# Altium project FMC_130MSPS.PrjPCB (part 1 of 3)
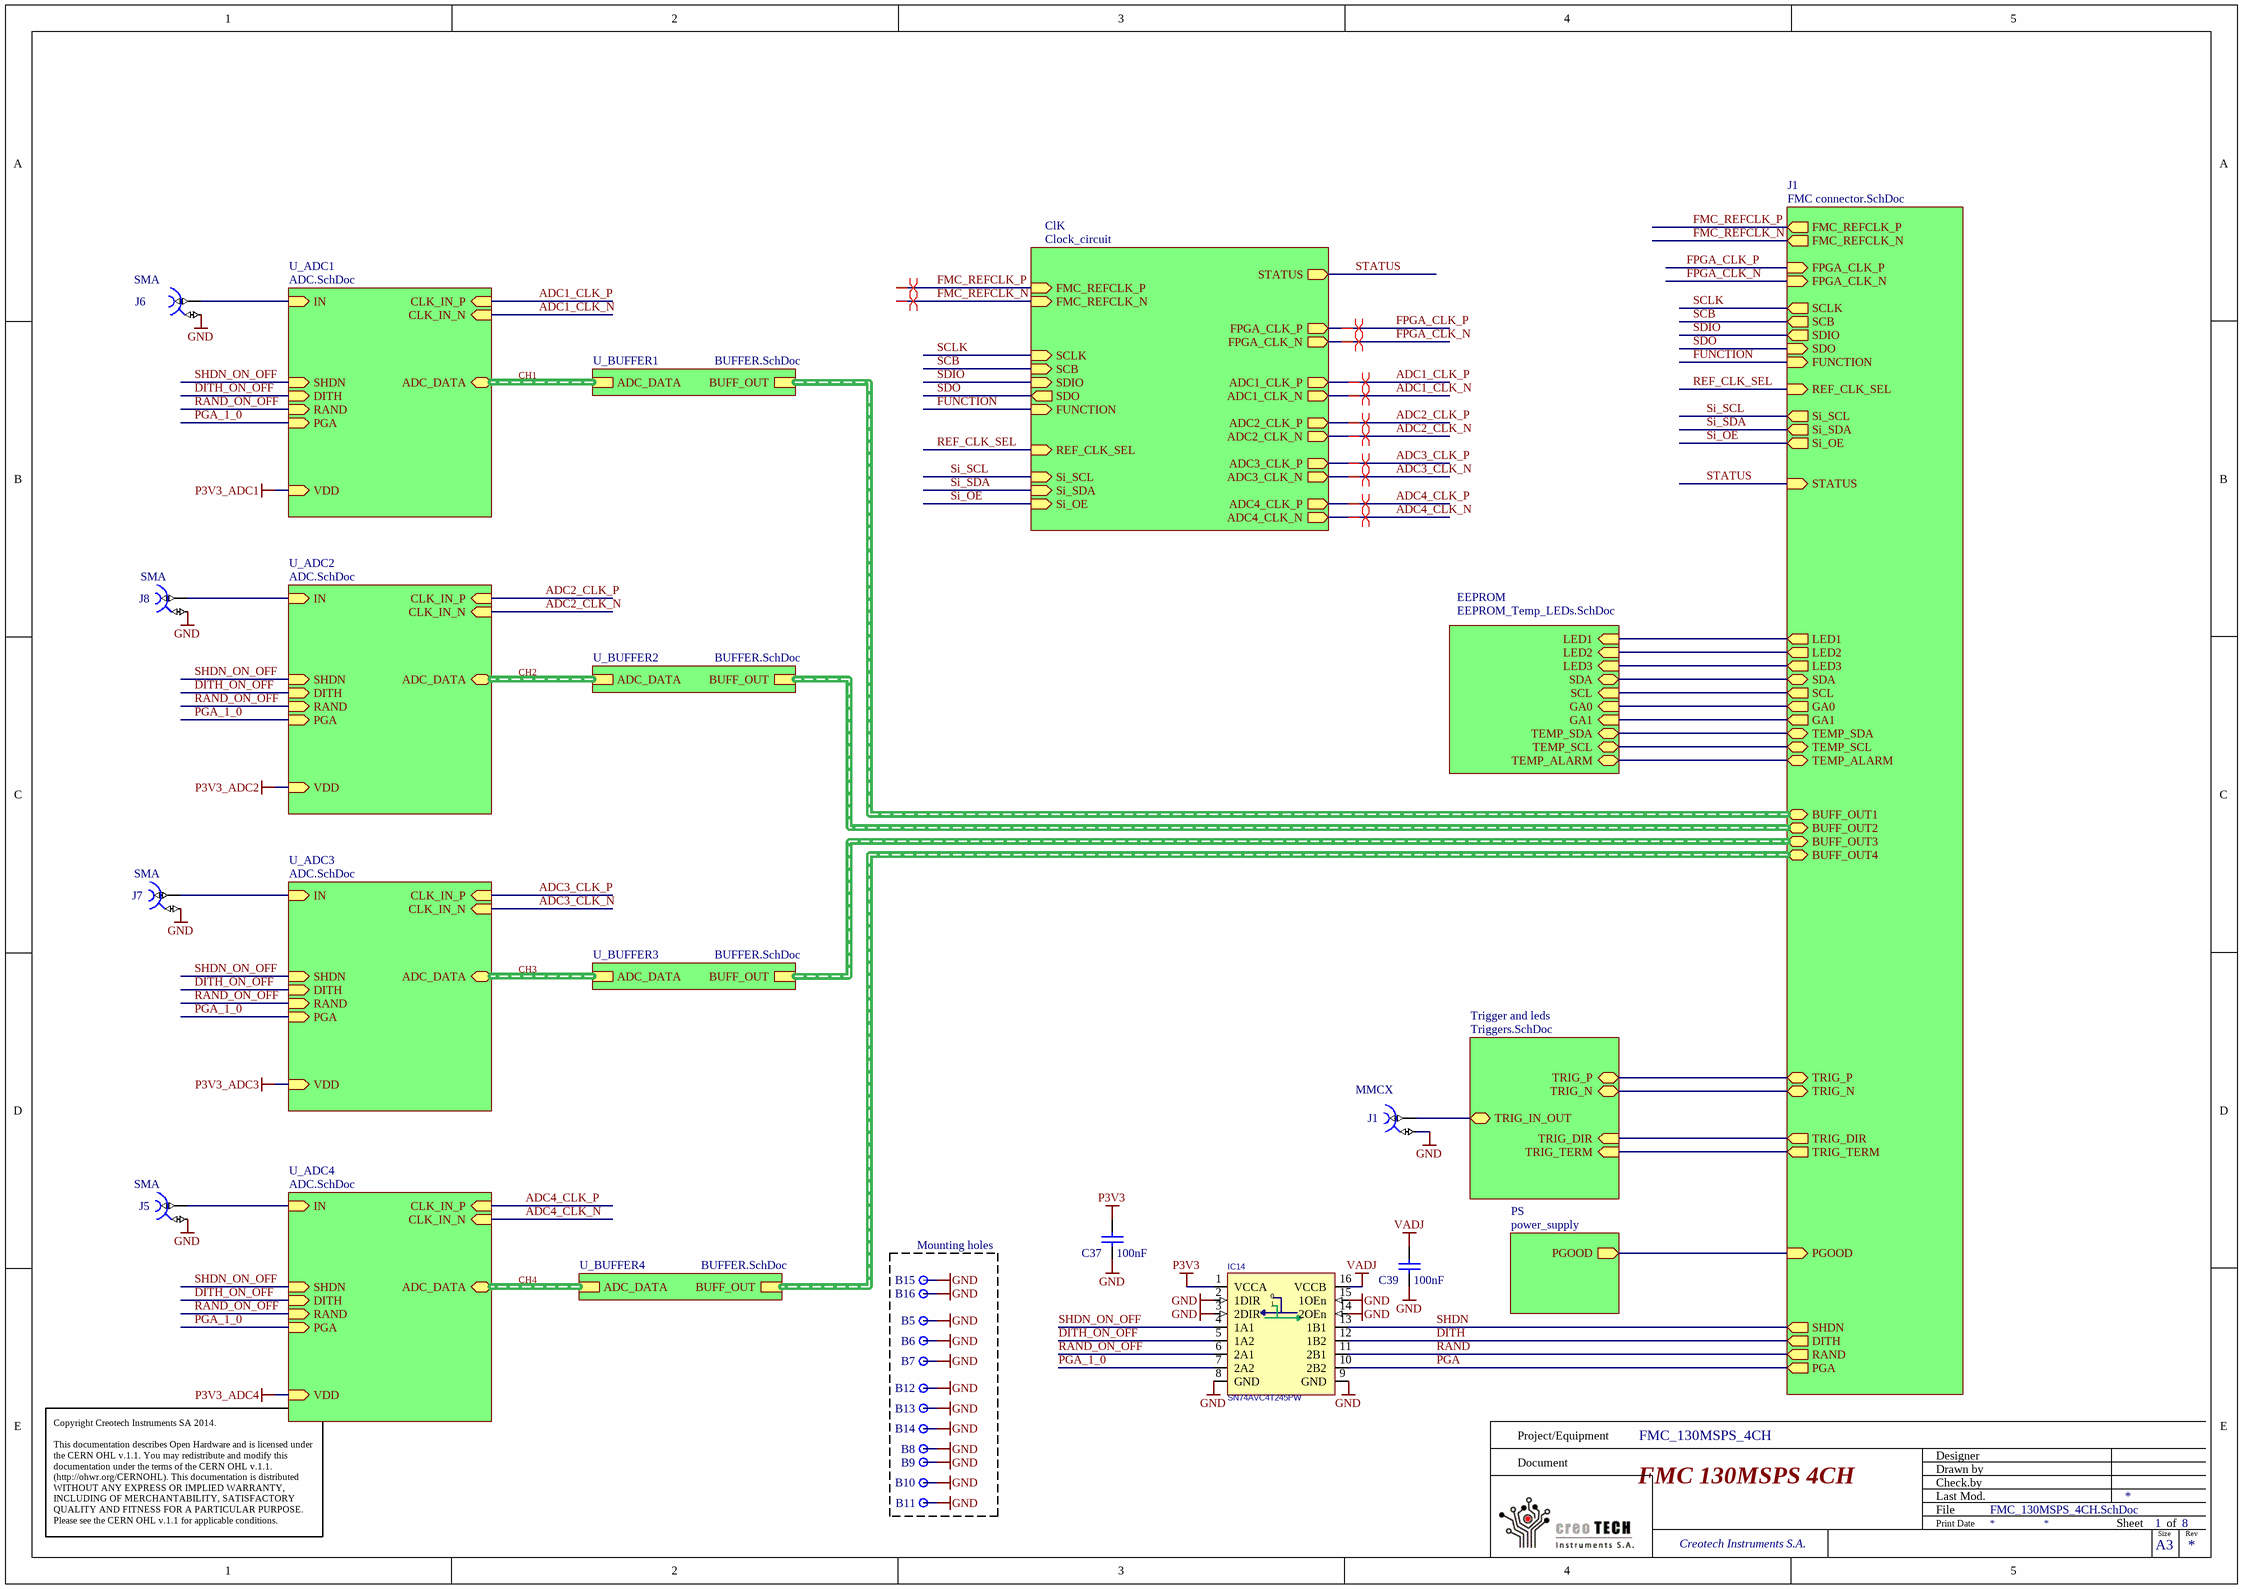
[diagram p0: FMC_130MSPS_4CH.SchDoc]
8 sheets, 406 parts. Net scope: hierarchical (ports join the sheet entries above them; power ports are global).
Board file: FMC_ADC_130M_16B_4CH.PcbDoc
Sheets:
  FMC_130MSPS_4CH.SchDoc
    PS = power_supply.SchDoc
    J1 = FMC connector.SchDoc
    ClK = Clock_circuit.SchDoc
    EEPROM = EEPROM_Temp_LEDs.SchDoc
    U_ADC1 = ADC.SchDoc
    Trigger and leds = Triggers.SchDoc
    U_ADC2 = ADC.SchDoc
    U_ADC3 = ADC.SchDoc
    U_ADC4 = ADC.SchDoc
    U_BUFFER2 = BUFFER.SchDoc
    U_BUFFER3 = BUFFER.SchDoc
    U_BUFFER1 = BUFFER.SchDoc
    U_BUFFER4 = BUFFER.SchDoc

## Sheet FMC_130MSPS_4CH.SchDoc: FMC 130MSPS 4CH
size 420 x 297 mm; SheetNumber: 1; SheetTotal: 8

### Parts
B5  Plated Hole  [MTG240_400]  (value not drawn)  (no BOM)
B6  Plated Hole  [MTG240_400]  (value not drawn)  (no BOM)
B7  Plated Hole  [MTG240_400]  (value not drawn)  (no BOM)
B8  Plated Hole  [MTG240_400]  (value not drawn)  (no BOM)
B9  Plated Hole  [MTG240_400]  (value not drawn)  (no BOM)
B10  Plated Hole  [MTG240_400]  (value not drawn)  (no BOM)
B11  Plated Hole  [MTG240_400]  (value not drawn)  (no BOM)
B12  Plated Hole  [MTG240_400]  (value not drawn)  (no BOM)
B13  Plated Hole  [MTG240_400]  (value not drawn)  (no BOM)
B14  Plated Hole  [MTG240_400]  (value not drawn)  (no BOM)
B15  Plated Hole  [MTG240_400]  (value not drawn)  (no BOM)
B16  Plated Hole  [MTG240_400]  (value not drawn)  (no BOM)
C37  100nF  [CAPC0603X33N]
C39  100nF  [CAPC0603X33N]
IC14  SN74AVC4T245PW  [TSSOP-16]
J1  Family: MMCX  [HUBER-SUHNER_85_MMCX-50-0-1/111 OH]  (hidden comment: Coax_1Female_1Shield)
J5  Family: SMA  [JOHNSON_142-0711-301]  (hidden comment: Coax_1Female_1Shield)
J6  Family: SMA  [JOHNSON_142-0711-301]  (hidden comment: Coax_1Female_1Shield)
J7  Family: SMA  [JOHNSON_142-0711-301]  (hidden comment: Coax_1Female_1Shield)
J8  Family: SMA  [JOHNSON_142-0711-301]  (hidden comment: Coax_1Female_1Shield)

### Blocks framed on the sheet
Mounting holes: B5-B16

### Sub-sheets
ClK = Clock_circuit: FPGA_CLK_P (out), FPGA_CLK_N (out), Si_SDA (in), Si_SCL (in), Si_OE (in), ADC1_CLK_P (out), ADC1_CLK_N (out), ADC2_CLK_P (out), ADC2_CLK_N (out), ADC3_CLK_P (out), ADC3_CLK_N (out), ADC4_CLK_P (out), ADC4_CLK_N (out), SCLK (in), SCB (in), SDIO (in), SDO (out), STATUS (out), FUNCTION (in), FMC_REFCLK_P (in), FMC_REFCLK_N (in), REF_CLK_SEL (in)
EEPROM = EEPROM_Temp_LEDs.SchDoc: LED1 (in), LED2 (in), SDA (bidir), SCL (in), GA0 (in), GA1 (in), LED3 (in), TEMP_SDA (bidir), TEMP_SCL (bidir), TEMP_ALARM (bidir)
J1 = FMC connector.SchDoc: BUFF_OUT1 (harness BUFF_OUT), BUFF_OUT2 (harness BUFF_OUT), BUFF_OUT4 (harness BUFF_OUT), BUFF_OUT3 (harness BUFF_OUT), SHDN (out), DITH (out), RAND (out), PGA (out), PGOOD (in), TRIG_DIR (out), TRIG_TERM (out), FMC_REFCLK_P (out), FMC_REFCLK_N (out), Si_SDA (out), Si_SCL (out), Si_OE (out), SCLK (out), SCB (out), SDIO (out), SDO (in), FUNCTION (in), STATUS (in), FPGA_CLK_P (in), FPGA_CLK_N (in), TRIG_N (bidir), TRIG_P (bidir), REF_CLK_SEL (in), LED1 (out), LED2 (out), SDA (bidir), SCL (out), GA0 (out), GA1 (out), LED3 (out), TEMP_SDA (bidir), TEMP_SCL (bidir), TEMP_ALARM (bidir)
PS = power_supply: PGOOD (out)
Trigger and leds = Triggers.SchDoc: TRIG_DIR (in), TRIG_N (bidir), TRIG_P (bidir), TRIG_TERM (in), TRIG_IN_OUT (bidir)
U_ADC1 = ADC.SchDoc: SHDN (in), IN (in), DITH (in), RAND (in), VDD, CLK_IN_P (in), CLK_IN_N (in), PGA (in), ADC_DATA (harness ADC_DATA)
U_ADC2 = ADC.SchDoc: SHDN (in), IN (in), DITH (in), RAND (in), VDD, CLK_IN_P (in), CLK_IN_N (in), PGA (in), ADC_DATA (harness ADC_DATA)
U_ADC3 = ADC.SchDoc: SHDN (in), IN (in), DITH (in), RAND (in), VDD, CLK_IN_P (in), CLK_IN_N (in), PGA (in), ADC_DATA (harness ADC_DATA)
U_ADC4 = ADC.SchDoc: SHDN (in), IN (in), DITH (in), RAND (in), VDD, CLK_IN_P (in), CLK_IN_N (in), PGA (in), ADC_DATA (harness ADC_DATA)
U_BUFFER1 = BUFFER.SchDoc: BUFF_OUT (harness BUFF_OUT), ADC_DATA (harness ADC_DATA)
U_BUFFER2 = BUFFER.SchDoc: BUFF_OUT (harness BUFF_OUT), ADC_DATA (harness ADC_DATA)
U_BUFFER3 = BUFFER.SchDoc: BUFF_OUT (harness BUFF_OUT), ADC_DATA (harness ADC_DATA)
U_BUFFER4 = BUFFER.SchDoc: BUFF_OUT (harness BUFF_OUT), ADC_DATA (harness ADC_DATA)

### Nets
GND: B5.1 B6.1 B7.1 B8.1 B9.1 B10.1 B11.1 B12.1 B13.1 B14.1 B15.1 B16.1 C37.1 C39.1 IC14.2(1DIR) IC14.3(2DIR) IC14.8(GND) IC14.9(GND) IC14.14(2OEn) IC14.15(1OEn) J1.2 J5.2 J6.2 J7.2 J8.2
P3V3: C37.2 IC14.1(VCCA)
VADJ: C39.2 IC14.16(VCCB)
ADC1_CLK_N: sheet ClK/ADC1_CLK_N, sheet U_ADC1/CLK_IN_N
ADC1_CLK_P: sheet ClK/ADC1_CLK_P, sheet U_ADC1/CLK_IN_P
ADC2_CLK_N: sheet ClK/ADC2_CLK_N, sheet U_ADC2/CLK_IN_N
ADC2_CLK_P: sheet ClK/ADC2_CLK_P, sheet U_ADC2/CLK_IN_P
ADC3_CLK_N: sheet ClK/ADC3_CLK_N, sheet U_ADC3/CLK_IN_N
ADC3_CLK_P: sheet ClK/ADC3_CLK_P, sheet U_ADC3/CLK_IN_P
ADC4_CLK_N: sheet ClK/ADC4_CLK_N, sheet U_ADC4/CLK_IN_N
ADC4_CLK_P: sheet ClK/ADC4_CLK_P, sheet U_ADC4/CLK_IN_P
DITH: IC14.12(1B2) ; sheet J1/DITH
DITH_ON_OFF: IC14.5(1A2) ; sheet U_ADC1/DITH, sheet U_ADC2/DITH, sheet U_ADC3/DITH, sheet U_ADC4/DITH
FMC_REFCLK_N: sheet J1/FMC_REFCLK_N, sheet ClK/FMC_REFCLK_N
FMC_REFCLK_P: sheet J1/FMC_REFCLK_P, sheet ClK/FMC_REFCLK_P
FPGA_CLK_N: sheet J1/FPGA_CLK_N, sheet ClK/FPGA_CLK_N  [project net CLK0_M2C_N]
FPGA_CLK_P: sheet J1/FPGA_CLK_P, sheet ClK/FPGA_CLK_P  [project net CLK0_M2C_P]
FUNCTION: sheet J1/FUNCTION, sheet ClK/FUNCTION
GA0: sheet J1/GA0, sheet EEPROM/GA0
GA1: sheet J1/GA1, sheet EEPROM/GA1
LA16_N: sheet J1/LED1, sheet EEPROM/LED1
LA16_P: sheet J1/LED2, sheet EEPROM/LED2
LA26_N: sheet J1/TRIG_TERM, sheet Trigger and leds/TRIG_TERM
LA26_P: sheet J1/LED3, sheet EEPROM/LED3
LA27_N: sheet J1/TEMP_SDA, sheet EEPROM/TEMP_SDA
LA27_P: sheet J1/TEMP_SCL, sheet EEPROM/TEMP_SCL
LA28_N: sheet J1/TEMP_ALARM, sheet EEPROM/TEMP_ALARM
LA28_P: sheet J1/TRIG_DIR, sheet Trigger and leds/TRIG_DIR
LA31_N: sheet PS/PGOOD, sheet J1/PGOOD
LA32_N: sheet J1/TRIG_N, sheet Trigger and leds/TRIG_N
LA32_P: sheet J1/TRIG_P, sheet Trigger and leds/TRIG_P
PGA: IC14.10(2B2) ; sheet J1/PGA  [project net LA06_P]
PGA_1_0: IC14.7(2A2) ; sheet U_ADC1/PGA, sheet U_ADC2/PGA, sheet U_ADC3/PGA, sheet U_ADC4/PGA
RAND: IC14.11(2B1) ; sheet J1/RAND  [project net LA06_N]
RAND_ON_OFF: IC14.6(2A1) ; sheet U_ADC1/RAND, sheet U_ADC2/RAND, sheet U_ADC3/RAND, sheet U_ADC4/RAND
REF_CLK_SEL: sheet J1/REF_CLK_SEL, sheet ClK/REF_CLK_SEL  [project net LA31_P]
RF3: J1.1 ; sheet Trigger and leds/TRIG_IN_OUT
SCB: sheet J1/SCB, sheet ClK/SCB  [project net LA13_N]
SCL: sheet J1/SCL, sheet EEPROM/SCL
SCLK: sheet J1/SCLK, sheet ClK/SCLK  [project net LA13_P]
SDA: sheet J1/SDA, sheet EEPROM/SDA
SDIO: sheet J1/SDIO, sheet ClK/SDIO  [project net LA09_N]
SDO: sheet J1/SDO, sheet ClK/SDO  [project net LA14_P]
SHDN: IC14.13(1B1) ; sheet J1/SHDN  [project net LA10_N]
SHDN_ON_OFF: IC14.4(1A1) ; sheet U_ADC1/SHDN, sheet U_ADC2/SHDN, sheet U_ADC3/SHDN, sheet U_ADC4/SHDN
Si_OE: sheet J1/Si_OE, sheet ClK/Si_OE  [project net HA12_P]
Si_SCL: sheet J1/Si_SCL, sheet ClK/Si_SCL  [project net HA12_N]
Si_SDA: sheet J1/Si_SDA, sheet ClK/Si_SDA  [project net HA13_P]
STATUS: sheet J1/STATUS, sheet ClK/STATUS  [project net LA09_P]
NetJ5_1: J5.1 ; sheet U_ADC4/IN
NetJ6_1: J6.1 ; sheet U_ADC1/IN
NetJ7_1: J7.1 ; sheet U_ADC3/IN
NetJ8_1: J8.1 ; sheet U_ADC2/IN

### Buses and harness runs
harness CH1 = sheet U_ADC1/ADC_DATA = sheet U_BUFFER1/ADC_DATA
harness CH2 = sheet U_ADC2/ADC_DATA = sheet U_BUFFER2/ADC_DATA
harness CH3 = sheet U_ADC3/ADC_DATA = sheet U_BUFFER3/ADC_DATA
harness CH4 = sheet U_ADC4/ADC_DATA = sheet U_BUFFER4/ADC_DATA
harness sheet J1/BUFF_OUT1 = sheet U_BUFFER1/BUFF_OUT
harness sheet J1/BUFF_OUT2 = sheet U_BUFFER2/BUFF_OUT
harness sheet J1/BUFF_OUT3 = sheet U_BUFFER3/BUFF_OUT
harness sheet J1/BUFF_OUT4 = sheet U_BUFFER4/BUFF_OUT

### Layout directives
differential pair: ADC1_CLK_N, ADC1_CLK_P, ADC2_CLK_N, ADC2_CLK_P, ADC3_CLK_N, ADC3_CLK_P, ADC4_CLK_N, ADC4_CLK_P, CLK0_M2C_N, CLK0_M2C_P, FMC_REFCLK_N, FMC_REFCLK_P

### Notes on the sheet
- Project/Equipment
- Document
- FMC_130MSPS_4CH
- Designer
- Drawn by
- Check.by
- Copyright Creotech Instruments SA 2014.
  This documentation describes Open Hardware and is licensed under the CERN OHL v.1.1. You may redistribute and modify this documentation under the terms of the CERN OHL v.1.1. (http://ohwr.org/CERNOHL). This documentation is distributed WITHOUT ANY EXPRESS OR IMPLIED WARRANTY, INCLUDING OF MERCHANTABILITY, SATISFACTORY QUALITY AND FITNESS FOR A PARTICULAR PURPOSE. Please see the CERN OHL v.1.1 for applicable conditions.
- Creotech Instruments S.A.
- File
- Last Mod.
- Print Date
- Sheet
- Size
- A3
- of
- Rev
- (in symbol 74AVC4T245) 0

### Library data of the parts
B5-B16 = PLATED_HOLE2.4_PAD4.0: Single Terminal Socket; Part Description: Plated Through Hole: Hole Dia.=2.4mm Pad Dia.=4.0mm; Mounted: No; Table: Pads; Part Number: PLATED_HOLE2.4_PAD4.0; Component Type: Standard (No BOM); Pin Count: 1; Family: Plated Hole; Socket: No; SMD: No; Status: None; ComponentHeight: 0mm; Author: CERN DEM JMW; CreateDate: 2011-10-10; LatestRevisionDate: 2011-10-10; PackageDescription: Plated Through Hole: Hole Dia.=2.4mm Pad Dia.=4.0mm
C37 C39 = CC0201_100NF_6.3V_10%_X5R: Non-polarised capacitor; Part Description: SMD Multilayer Chip Ceramic Capacitor; Manufacturer: GENERIC; Manufacturer1 Part Number: 02016D104KAT2A; Voltage: 6.3V; TC: X5R; Tolerance: ±10%; Table: Capacitors SMD; Part Number: CC0201_100NF_6.3V_10%_X5R; Component Kind: Standard; Component Type: Standard; Pin Count: 2; Value: 100nF; Status: Not Recommended; Manufacturer Part Number: CC0201_100NF_6.3V_10%_X5R; Case: 0201; Mounted: Yes; Socket: No; SMD: Yes; Manufacturer1 Example: AVX; Manufacturer1 ComponentHeight: 0.33mm; HelpURL: \\cern.ch\dfs\Applications\Altium\Datasheets\CC0201_X5R_AVX.pdf; Author: CERN DEM JLC; CreateDate: 2007-12-03; LatestRevisionDate: 2007-12-03
IC14 = 74AVC4T245: 4-BIT DUAL-SUPPLY BUS TRANSCEIVER
J1 = HUBER-SUHNER_85_MMCX-50-0-1/111 OH: Part Description: MMCX 50 Ohms Right Angle PCB Jack; Manufacturer: HUBER+SUHNER; Table: Miscellaneous; Part Number: HUBER-SUHNER_85_MMCX-50-0-1/111 OH; Component Kind: Standard; Component Type: Standard; Pin Count: 2; Mounted: Yes; Socket: No; SMD: No; Status: None; Manufacturer Part Number: 85_MMCX-50-0-1/111 OH; ComponentHeight: 9.6mm; HelpURL: \\cern.ch\dfs\Applications\Altium\Datasheets\HUBER-SUHNER_85_MMCX-50-0-1-111 OH.pdf; Author: CERN DEM JLC; CreateDate: 4/10/2011; LatestRevisionDate: 4/10/2011
J5-J8 = JOHNSON_142-0711-301: Part Description: SMA 50 Ohms Right Angled Jack Receptacle - Surface Mount; Table: Miscellaneous; Part Number: JOHNSON_142-0711-301; Component Kind: Standard; Component Type: Standard; Pin Count: 2; Mounted: Yes; Socket: No; SMD: Yes; Status: None; Manufacturer: JOHNSON; Manufacturer Part Number: 142-0711-301; ComponentHeight: 8.26mm; HelpURL: \\cern.ch\dfs\Applications\Altium\Datasheets\JOHNSON_142-0711-301.pdf; Author: CERN DEM JLC; CreateDate: 15/10/2012; LatestRevisionDate: 15/10/2012

## Sheet power_supply.SchDoc: power supply
size 420 x 297 mm; SheetNumber: 6; SheetTotal: 8
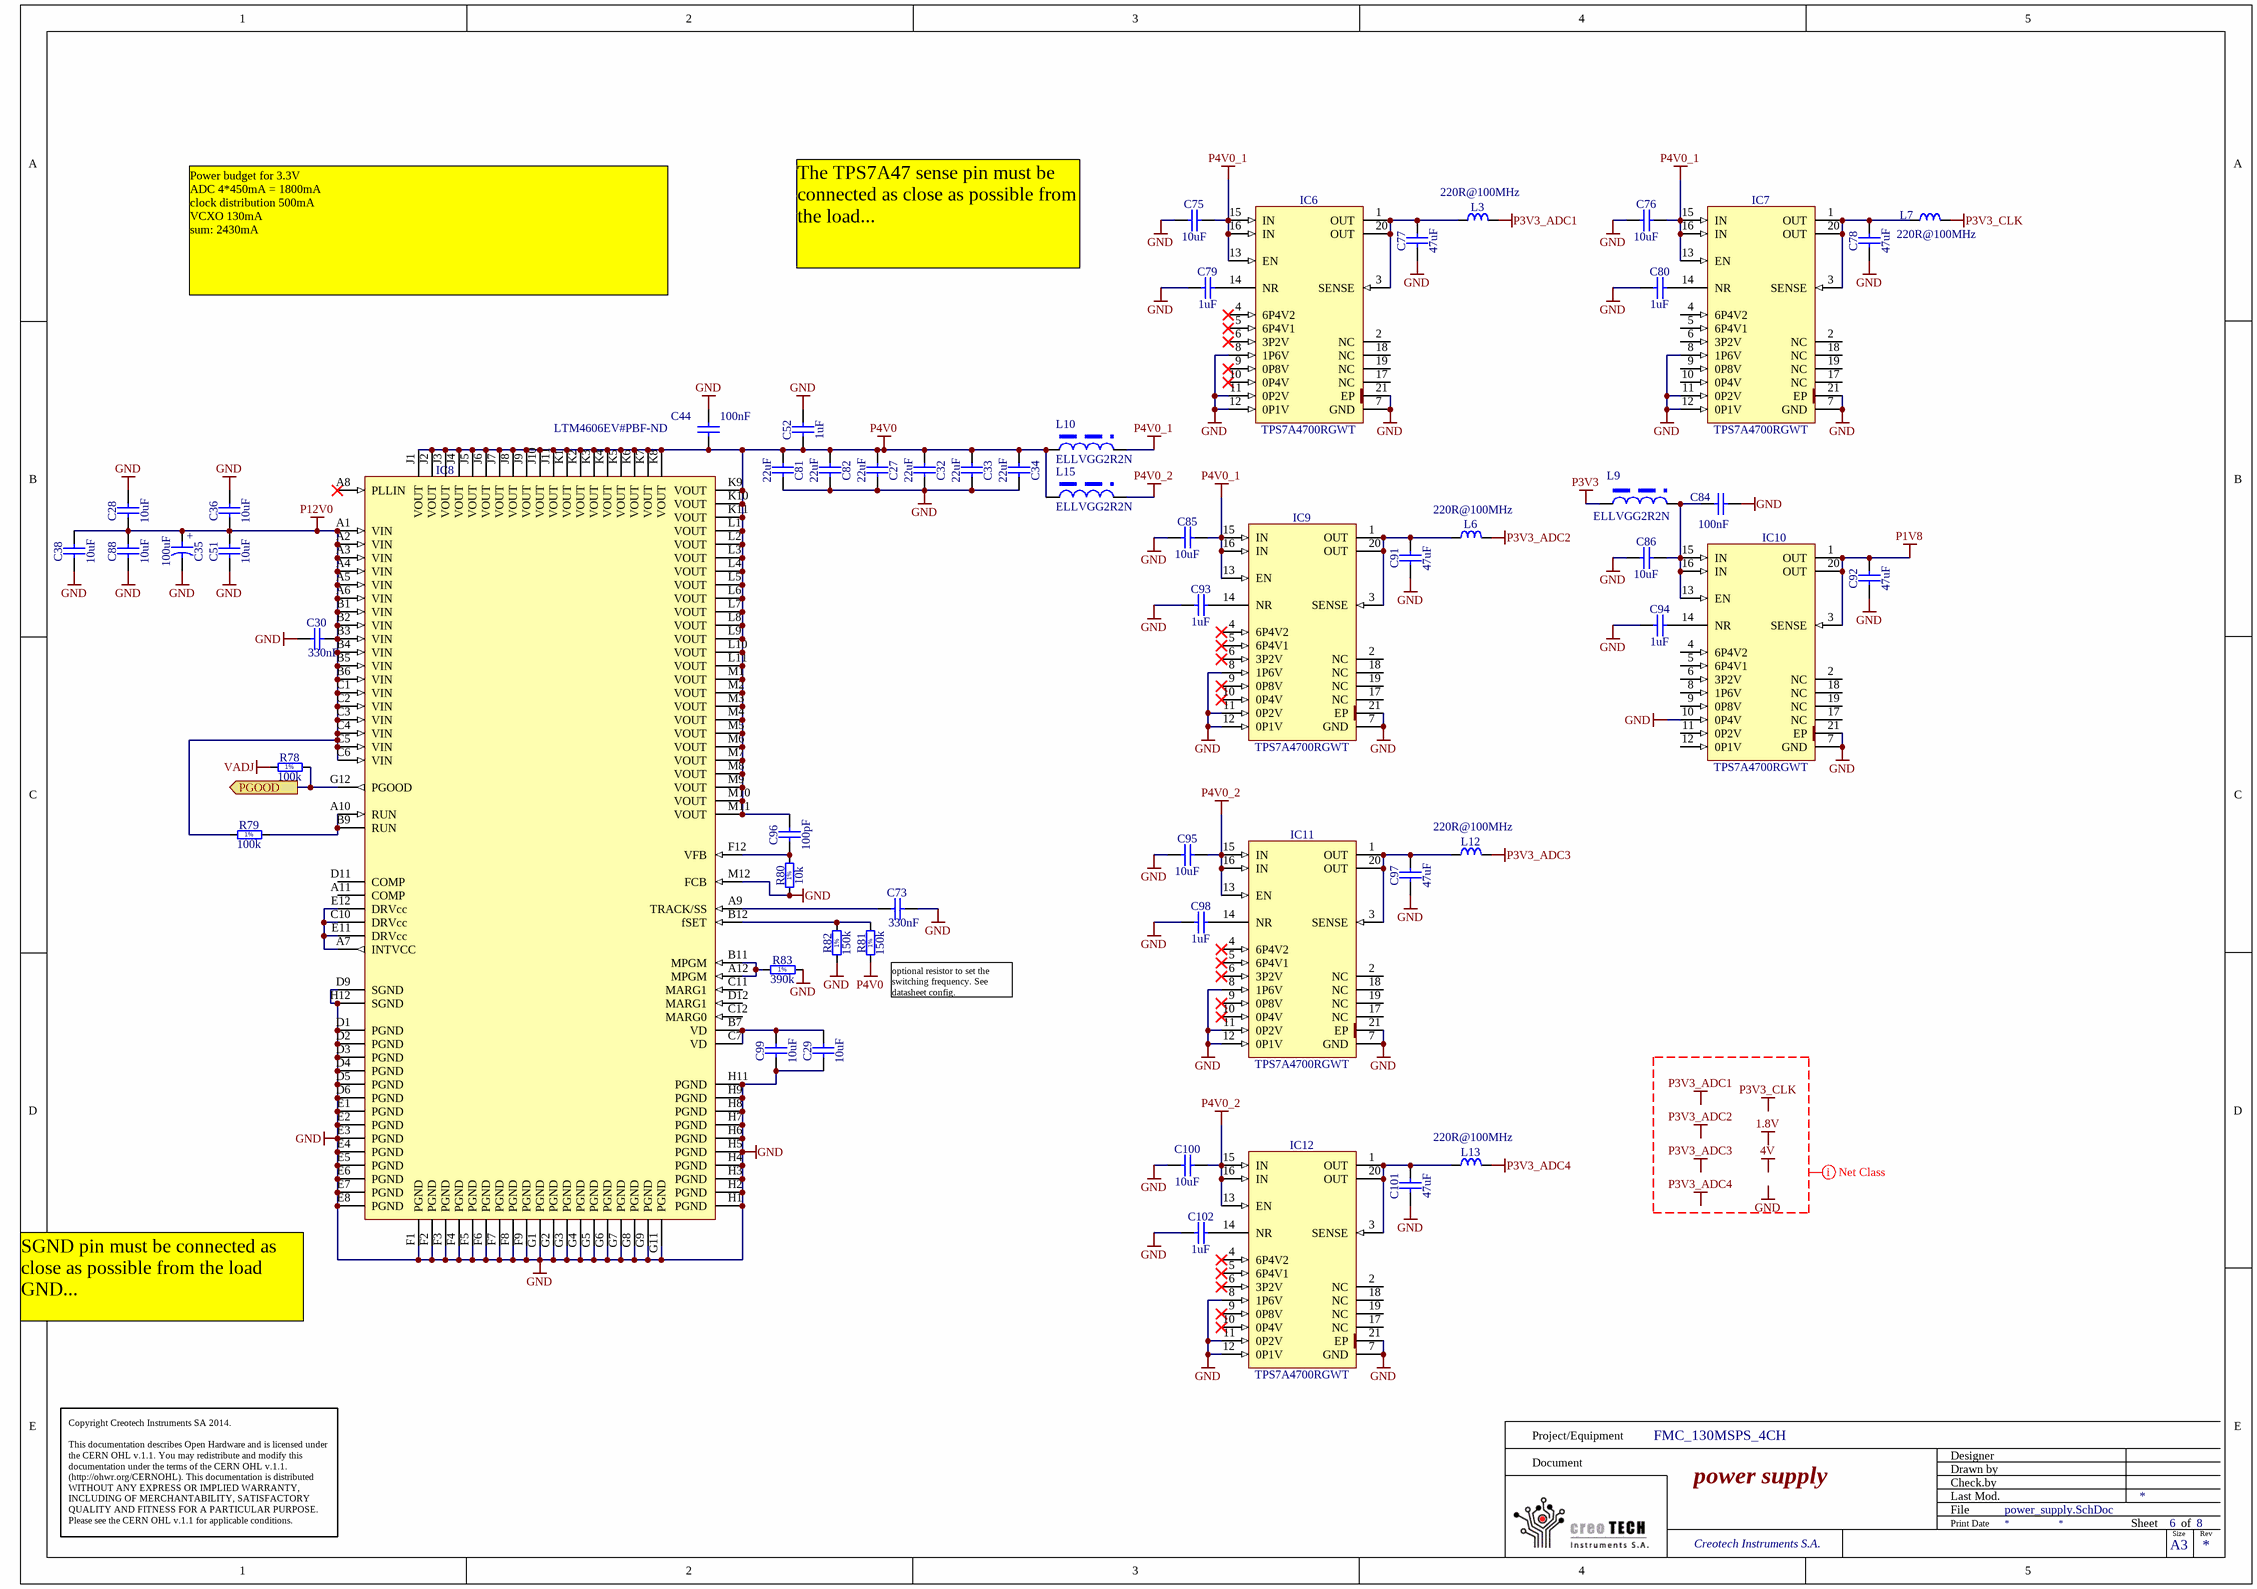
[diagram p1: power_supply.SchDoc]

### Parts
C27  22uF  [CAPC3216X140N]
C28  10uF  [CAPC2012X135N]
C29  10uF  [CAPC2012X135N]
C30  330nF  [CAPC1608X87N]
C32  22uF  [CAPC3216X140N]
C33  22uF  [CAPC3216X140N]
C34  22uF  [CAPC3216X140N]
C35  100uF  [CAPMP7343X310N]
C36  10uF  [CAPC2012X135N]
C38  10uF  [CAPC2012X135N]
C44  100nF  [CAPC0603X33N]
C51  10uF  [CAPC2012X135N]
C52  1uF  [CAPC1608X87N]
C73  330nF  [CAPC1608X87N]
C75  10uF  [CAPC2012X135N]
C76  10uF  [CAPC2012X135N]
C77  47uF  [CAPC2012X140N]
C78  47uF  [CAPC2012X140N]
C79  1uF  [CAPC1608X87N]
C80  1uF  [CAPC1608X87N]
C81  22uF  [CAPC3216X140N]
C82  22uF  [CAPC3216X140N]
C84  100nF  [CAPC0603X33N]
C85  10uF  [CAPC2012X135N]
C86  10uF  [CAPC2012X135N]
C88  10uF  [CAPC2012X135N]
C91  47uF  [CAPC2012X140N]
C92  47uF  [CAPC2012X140N]
C93  1uF  [CAPC1608X87N]
C94  1uF  [CAPC1608X87N]
C95  10uF  [CAPC2012X135N]
C96  100pF  [CAPC1005X55N]
C97  47uF  [CAPC2012X140N]
C98  1uF  [CAPC1608X87N]
C99  10uF  [CAPC2012X135N]
C100  10uF  [CAPC2012X135N]
C101  47uF  [CAPC2012X140N]
C102  1uF  [CAPC1608X87N]
IC6  TPS7A4700RGWT  [QFN65P500X500X100-21N-S325]
IC7  TPS7A4700RGWT  [QFN65P500X500X100-21N-S325]
IC8  LTM4606EV#PBF-ND  [LTM4606]
IC9  TPS7A4700RGWT  [QFN65P500X500X100-21N-S325]
IC10  TPS7A4700RGWT  [QFN65P500X500X100-21N-S325]
IC11  TPS7A4700RGWT  [QFN65P500X500X100-21N-S325]
IC12  TPS7A4700RGWT  [QFN65P500X500X100-21N-S325]
L3  220R@100MHz  [INDC2012X105N]
L6  220R@100MHz  [INDC2012X105N]
L7  220R@100MHz  [INDC2012X105N]
L9  ELLVGG2R2N  [L_ELLVGG2R2N]
L10  ELLVGG2R2N  [L_ELLVGG2R2N]
L12  220R@100MHz  [INDC2012X105N]
L13  220R@100MHz  [INDC2012X105N]
L15  ELLVGG2R2N  [L_ELLVGG2R2N]
R78  100k  [RESC1005X40N]
R79  100k  [RESC1005X40N]
R80  10k  [RESC1005X40N]
R81  150k  [RESC1005X40N]
R82  150k  [RESC1005X40N]
R83  390k  [RESC1005X40N]

### Ports
PGOOD (out)

### Nets
GND: C27.2 C28.2 C29.1 C30.1 C32.2 C33.2 C34.2 C35.2 C36.2 C38.1 C44.1 C51.1 C52.2 C73.2 C75.1 C76.1 C77.1 C78.1 C79.1 C80.1 C81.2 C82.2 C84.1 C85.1 C86.1 C88.1 C91.1 C92.1 C93.1 C94.1 C95.1 C97.1 C98.1 C99.1 C100.1 C101.1 C102.1 IC6.7(GND) IC6.8(1P6V) IC6.11(0P2V) IC6.12(0P1V) IC6.21(EP) IC7.7(GND) IC7.8(1P6V) IC7.11(0P2V) IC7.12(0P1V) IC7.21(EP) IC8.D1(PGND) IC8.D2(PGND) IC8.D3(PGND) IC8.D4(PGND) IC8.D5(PGND) IC8.D6(PGND) IC8.D9(SGND) IC8.E1(PGND) IC8.E2(PGND) IC8.E3(PGND) IC8.E4(PGND) IC8.E5(PGND) IC8.E6(PGND) IC8.E7(PGND) IC8.E8(PGND) IC8.F1(PGND) IC8.F2(PGND) IC8.F3(PGND) IC8.F4(PGND) IC8.F5(PGND) IC8.F6(PGND) IC8.F7(PGND) IC8.F8(PGND) IC8.F9(PGND) IC8.G1(PGND) IC8.G2(PGND) IC8.G3(PGND) IC8.G4(PGND) IC8.G5(PGND) IC8.G6(PGND) IC8.G7(PGND) IC8.G8(PGND) IC8.G9(PGND) IC8.G11(PGND) IC8.H1(PGND) IC8.H2(PGND) IC8.H3(PGND) IC8.H4(PGND) IC8.H5(PGND) IC8.H6(PGND) IC8.H7(PGND) IC8.H8(PGND) IC8.H9(PGND) IC8.H11(PGND) IC8.H12(SGND) IC8.M12(FCB) IC9.7(GND) IC9.8(1P6V) IC9.11(0P2V) IC9.12(0P1V) IC9.21(EP) IC10.7(GND) IC10.10(0P4V) IC10.21(EP) IC11.7(GND) IC11.8(1P6V) IC11.11(0P2V) IC11.12(0P1V) IC11.21(EP) IC12.7(GND) IC12.8(1P6V) IC12.11(0P2V) IC12.12(0P1V) IC12.21(EP) R80.2 R82.1 R83.2
P1V8: C92.2 IC10.1(OUT) IC10.3(SENSE) IC10.20(OUT)
P3V3: L9.1
P3V3_ADC1: L3.2
P3V3_ADC2: L6.2
P3V3_ADC3: L12.2
P3V3_ADC4: L13.2
P3V3_CLK: L7.2
P4V0: C27.1 C32.1 C33.1 C34.1 C44.2 C52.1 C81.1 C82.1 C96.2 IC8.J1(VOUT) IC8.J2(VOUT) IC8.J3(VOUT) IC8.J4(VOUT) IC8.J5(VOUT) IC8.J6(VOUT) IC8.J7(VOUT) IC8.J8(VOUT) IC8.J9(VOUT) IC8.J10(VOUT) IC8.J11(VOUT) IC8.K1(VOUT) IC8.K2(VOUT) IC8.K3(VOUT) IC8.K4(VOUT) IC8.K5(VOUT) IC8.K6(VOUT) IC8.K7(VOUT) IC8.K8(VOUT) IC8.K9(VOUT) IC8.K10(VOUT) IC8.K11(VOUT) IC8.L1(VOUT) IC8.L2(VOUT) IC8.L3(VOUT) IC8.L4(VOUT) IC8.L5(VOUT) IC8.L6(VOUT) IC8.L7(VOUT) IC8.L8(VOUT) IC8.L9(VOUT) IC8.L10(VOUT) IC8.L11(VOUT) IC8.M1(VOUT) IC8.M2(VOUT) IC8.M3(VOUT) IC8.M4(VOUT) IC8.M5(VOUT) IC8.M6(VOUT) IC8.M7(VOUT) IC8.M8(VOUT) IC8.M9(VOUT) IC8.M10(VOUT) IC8.M11(VOUT) L10.1 L15.1 R81.1
P4V0_1: C75.2 C76.2 C85.2 IC6.13(EN) IC6.15(IN) IC6.16(IN) IC7.13(EN) IC7.15(IN) IC7.16(IN) IC9.13(EN) IC9.15(IN) IC9.16(IN) L10.2
P4V0_2: C95.2 C100.2 IC11.13(EN) IC11.15(IN) IC11.16(IN) IC12.13(EN) IC12.15(IN) IC12.16(IN) L15.2
P12V0: C28.1 C30.2 C35.1 C36.1 C38.2 C51.2 C88.2 IC8.A1(VIN) IC8.A2(VIN) IC8.A3(VIN) IC8.A4(VIN) IC8.A5(VIN) IC8.A6(VIN) IC8.B1(VIN) IC8.B2(VIN) IC8.B3(VIN) IC8.B4(VIN) IC8.B5(VIN) IC8.B6(VIN) IC8.C1(VIN) IC8.C2(VIN) IC8.C3(VIN) IC8.C4(VIN) IC8.C5(VIN) IC8.C6(VIN) R79.1
VADJ: R78.1
LA31_N: IC8.G12(PGOOD) R78.2 ; port PGOOD
NetC29_2: C29.2 C99.2 IC8.B7(VD) IC8.C7(VD)
NetC73_1: C73.1 IC8.A9(TRACK/SS)
NetC77_2: C77.2 IC6.1(OUT) IC6.3(SENSE) IC6.20(OUT) L3.1
NetC78_2: C78.2 IC7.1(OUT) IC7.3(SENSE) IC7.20(OUT) L7.1
NetC79_2: C79.2 IC6.14(NR)
NetC80_2: C80.2 IC7.14(NR)
NetC84_2: C84.2 C86.2 IC10.13(EN) IC10.15(IN) IC10.16(IN) L9.2
NetC91_2: C91.2 IC9.1(OUT) IC9.3(SENSE) IC9.20(OUT) L6.1
NetC93_2: C93.2 IC9.14(NR)
NetC94_2: C94.2 IC10.14(NR)
NetC96_1: C96.1 IC8.F12(VFB) R80.1
NetC97_2: C97.2 IC11.1(OUT) IC11.3(SENSE) IC11.20(OUT) L12.1
NetC98_2: C98.2 IC11.14(NR)
NetC101_2: C101.2 IC12.1(OUT) IC12.3(SENSE) IC12.20(OUT) L13.1
NetC102_2: C102.2 IC12.14(NR)
NetIC8_A7: IC8.A7(INTVCC) IC8.C10(DRVcc) IC8.E11(DRVcc) IC8.E12(DRVcc)
NetIC8_A10: IC8.A10(RUN) IC8.B9(RUN) R79.2
NetIC8_A12: IC8.A12(MPGM) IC8.B11(MPGM) R83.1
NetIC8_B12: IC8.B12(fSET) R81.2 R82.2

Not connected (* = marked no-connect by the designer): IC6 2(NC) 4(6P4V2)* 5(6P4V1)* 6(3P2V)* 9(0P8V)* 10(0P4V)* 17(NC) 18(NC) 19(NC); IC7 2(NC) 4(6P4V2) 5(6P4V1) 6(3P2V) 9(0P8V) 10(0P4V) 17(NC) 18(NC) 19(NC); IC8 A8(PLLIN)* A11(COMP) C11(MARG1) C12(MARG0) D11(COMP) D12(MARG1) J12(NC) K12(NC) L12(NC); IC9 2(NC) 4(6P4V2)* 5(6P4V1)* 6(3P2V)* 9(0P8V)* 10(0P4V)* 17(NC) 18(NC) 19(NC); IC10 2(NC) 4(6P4V2) 5(6P4V1) 6(3P2V) 8(1P6V) 9(0P8V) 11(0P2V) 12(0P1V) 17(NC) 18(NC) 19(NC); IC11 2(NC) 4(6P4V2)* 5(6P4V1)* 6(3P2V)* 9(0P8V)* 10(0P4V)* 17(NC) 18(NC) 19(NC); IC12 2(NC) 4(6P4V2)* 5(6P4V1)* 6(3P2V)* 9(0P8V)* 10(0P4V)* 17(NC) 18(NC) 19(NC)

### Layout directives
net class Power: 1.8V, 4V, GND, P3V3_ADC1, P3V3_ADC2, P3V3_ADC3, P3V3_ADC4, P3V3_CLK

### Notes on the sheet
- The TPS7A47 sense pin must be connected as close as possible from the load...
- Power budget for 3.3V
  ADC 4*450mA = 1800mA
  clock distribution 500mA
  VCXO 130mA
  sum: 2430mA
- (near R81) optional resistor to set the switching frequency. See datasheet config.
- SGND pin must be connected as close as possible from the load GND...
- Labels drawn without touching a wire or pin: 1.8V, 4V, GND, P3V3_ADC1, P3V3_ADC2, P3V3_ADC3, P3V3_ADC4, P3V3_CLK
- Project/Equipment
- Document
- FMC_130MSPS_4CH
- Designer
- Drawn by
- Check.by
- Copyright Creotech Instruments SA 2014.
  This documentation describes Open Hardware and is licensed under the CERN OHL v.1.1. You may redistribute and modify this documentation under the terms of the CERN OHL v.1.1. (http://ohwr.org/CERNOHL). This documentation is distributed WITHOUT ANY EXPRESS OR IMPLIED WARRANTY, INCLUDING OF MERCHANTABILITY, SATISFACTORY QUALITY AND FITNESS FOR A PARTICULAR PURPOSE. Please see the CERN OHL v.1.1 for applicable conditions.
- Creotech Instruments S.A.
- File
- Last Mod.
- Print Date
- Sheet
- Size
- A3
- of
- Rev
- (in symbol CTE7343-31_100UF_20V_10%) +
- (in symbol R0402_10K_1%_0.0625W_100PPM) 1%
- (in symbol R0402_100K_1%_0.0625W_100PPM) 1%
- (in symbol R0402_150K_1%_0.0625W_100PPM) 1%
- (in symbol R0402_390K_1%_0.0625W_100PPM) 1%

### Library data of the parts
C27 C32-C34 C81 C82 = CC1206_22UF_6.3V_20%_X5R: Non-polarised capacitor; Part Description: SMD Multilayer Chip Ceramic Capacitor; Manufacturer: GENERIC; Manufacturer1 Part Number: C1206C226K9PAC; Voltage: 6.3V; TC: X5R; Tolerance: ±20%; Table: Capacitors SMD; Part Number: CC1206_22UF_6.3V_20%_X5R; Component Kind: Standard; Component Type: Standard; Pin Count: 2; Value: 22uF; Status: Preferred; Manufacturer Part Number: CC1206_22UF_6.3V_20%_X5R; Case: 1206; Mounted: Yes; Socket: No; SMD: Yes; Manufacturer1 Example: KEMET; Manufacturer1 ComponentHeight: 1.8mm; HelpURL: \\cern.ch\dfs\Applications\Altium\Datasheets\CC1206_X5R_KEMET.pdf; Author: CERN DEM JLC; CreateDate: 3/12/2007; LatestRevisionDate: 3/12/2007
C28 C29 C36 C38 C51 C88 C99 = CC0805_10UF_16V_10%_X5R: Non-polarised capacitor; Part Description: SMD Multilayer Chip Ceramic Capacitor; Manufacturer: GENERIC; Manufacturer1 Part Number: C0805C106K4PAC; Voltage: 16V; TC: X5R; Tolerance: ±10%; Table: Capacitors SMD; Part Number: CC0805_10UF_16V_10%_X5R; Component Kind: Standard; Component Type: Standard; Pin Count: 2; Value: 10uF; Status: Preferred; Manufacturer Part Number: CC0805_10UF_16V_10%_X5R; Case: 0805; Mounted: Yes; Socket: No; SMD: Yes; Manufacturer1 Example: KEMET; Manufacturer1 ComponentHeight: 1.4mm; HelpURL: \\cern.ch\dfs\Applications\Altium\Datasheets\CC1206_X5R_KEMET.pdf; Author: CERN DEM JLC; CreateDate: 3/12/2007; LatestRevisionDate: 3/12/2007
C30 C73 = CC0603_330NF_16V_10%_X5R: Non-polarised capacitor; Part Description: SMD Multilayer Chip Ceramic Capacitor; Manufacturer: GENERIC; Manufacturer1 Part Number: 223878613656; Voltage: 16V; TC: X5R; Tolerance: ±10%; Table: Capacitors SMD; Part Number: CC0603_330NF_16V_10%_X5R; Component Kind: Standard; Component Type: Standard; Pin Count: 2; Value: 330nF; Status: Preferred; Manufacturer Part Number: CC0603_330NF_16V_10%_X5R; Case: 0603; Mounted: Yes; Socket: No; SMD: Yes; Manufacturer1 Example: PHYCOMP; Manufacturer1 ComponentHeight: 0.87mm; HelpURL: \\cern.ch\dfs\Applications\Altium\Datasheets\CC0805_X5R_PHYCOMP_HC.pdf; Author: CERN DEM JLC; CreateDate: 3/12/2007; LatestRevisionDate: 3/12/2007
C35 = CTE7343-31_100UF_20V_10%: Polarised capacitor; Part Description: Solid Tantalum Chip Capacitor; Manufacturer: GENERIC; Manufacturer1 Part Number: TAJD107K020R; Voltage: 20V; Tolerance: ±10%; Table: Capacitors SMD; Part Number: CTE7343-31_100UF_20V_10%; Component Kind: Standard; Component Type: Standard; Pin Count: 2; Value: 100uF; Status: Preferred; Manufacturer Part Number: CTE7343-31_100UF_20V_10%; Case: D; Mounted: Yes; Socket: No; SMD: Yes; Manufacturer1 Example: AVX; Manufacturer1 ComponentHeight: 3.1mm; HelpURL: \\cern.ch\dfs\Applications\Altium\Datasheets\CTE_AVX_TAJ.pdf; Author: CERN DEM JLC; CreateDate: 3/12/2007; LatestRevisionDate: 3/12/2007
C44 C84 = CC0201_100NF_6.3V_10%_X5R: as C37 on sheet FMC_130MSPS_4CH; Part Number: CC0201_100NF_6.3V_10%_X5R; Component Kind: Standard; Component Type: Standard; Pin Count: 2; Value: 100nF; Status: Not Recommended; Manufacturer Part Number: CC0201_100NF_6.3V_10%_X5R; Case: 0201; Mounted: Yes; Socket: No; SMD: Yes; Manufacturer1 Example: AVX; Manufacturer1 ComponentHeight: 0.33mm; HelpURL: \\cern.ch\dfs\Applications\Altium\Datasheets\CC0201_X5R_AVX.pdf; Author: CERN DEM JLC; CreateDate: 2007-12-03; LatestRevisionDate: 2007-12-03
C52 C79 C80 C93 C94 C98 C102 = CC0603_1UF_25V_10%_X7R: Non-polarised capacitor; Part Description: SMD Multilayer Chip Ceramic Capacitor; Manufacturer: GENERIC; Manufacturer1 Part Number: GRM188R71E105KA12D; Voltage: 25V; TC: X7R; Tolerance: ±10%; Table: Capacitors SMD; Part Number: CC0603_1UF_25V_10%_X7R; Component Kind: Standard; Component Type: Standard; Pin Count: 2; Value: 1uF; Status: None; Manufacturer Part Number: CC0603_1UF_25V_10%_X7R; Case: 0603; Mounted: Yes; Socket: No; SMD: Yes; Manufacturer1 Example: MURATA; Manufacturer1 ComponentHeight: 0.9mm; HelpURL: \\cern.ch\dfs\Applications\Altium\Datasheets\CC0603_X7R_MURATA.pdf; Author: CERN DEM JLC; CreateDate: 18/1/2011; LatestRevisionDate: 18/1/2011
C75 C76 C85 C86 C95 C100 = CC0805_10UF_10V_10%_X7R: Non-polarised capacitor; Part Description: SMD Multilayer Chip Ceramic Capacitor; Manufacturer: GENERIC; Manufacturer1 Part Number: GRM21BR71A106KE51L; Voltage: 10V; TC: X7R; Tolerance: ±10%; Table: Capacitors SMD; Part Number: CC0805_10UF_10V_10%_X7R; Component Kind: Standard; Component Type: Standard; Pin Count: 2; Value: 10uF; Status: Preferred; Manufacturer Part Number: CC0805_10UF_10V_10%_X7R; Case: 0805; Mounted: Yes; Socket: No; SMD: Yes; Manufacturer1 Example: MURATA; Manufacturer1 ComponentHeight: 1.35mm; HelpURL: \\cern.ch\dfs\Applications\Altium\Datasheets\CC0805_X7R_MURATA.pdf; Author: CERN DEM JLC; CreateDate: 30/4/2012; LatestRevisionDate: 30/4/2012
C77 C78 C91 C92 C97 C101 = CC0805_47UF_6.3V_20%_X5R: Non-polarised capacitor; Part Description: SMD Multilayer Chip Ceramic Capacitor; Manufacturer: GENERIC; Manufacturer1 Part Number: C0805C476M9PACTU; Voltage: 6.3V; TC: X5R; Tolerance: ±20%; Table: Capacitors SMD; Part Number: CC0805_47UF_6.3V_20%_X5R; Component Kind: Standard; Component Type: Standard; Pin Count: 2; Value: 47uF; Status: Preferred; Manufacturer Part Number: CC0805_47UF_6.3V_20%_X5R; Case: 0805; Mounted: Yes; Socket: No; SMD: Yes; Manufacturer1 Example: KEMET; Manufacturer1 ComponentHeight: 1.4mm; HelpURL: \\cern.ch\dfs\Applications\Altium\Datasheets\CC0805_X5R_KEMET.pdf; Author: CERN DEM JLC; CreateDate: 16/10/2012; LatestRevisionDate: 16/10/2012
C96 = CC0402_100PF_50V_5%_NP0: Non-polarised capacitor; Part Description: SMD Multilayer Chip Ceramic Capacitor; Manufacturer: GENERIC; Manufacturer1 Part Number: 223886915101; Voltage: 50V; TC: NP0; Tolerance: ±5%; Table: Capacitors SMD; Part Number: CC0402_100PF_50V_5%_NP0; Component Kind: Standard; Component Type: Standard; Pin Count: 2; Value: 100pF; Status: Not Recommended; Manufacturer Part Number: CC0402_100PF_50V_5%_NP0; Case: 0402; Mounted: Yes; Socket: No; SMD: Yes; Manufacturer1 Example: PHYCOMP; Manufacturer1 ComponentHeight: 0.55mm; HelpURL: \\cern.ch\dfs\Applications\Altium\Datasheets\CC0402_NP0_PHYCOMP.pdf; Author: CERN DEM JLC; CreateDate: 3/12/2007; LatestRevisionDate: 3/12/2007
IC6 IC7 IC9-IC12 = TPS7A4700RGWT: Low Noise (3uVrms), 1A, High Voltage Low-Dropout Linear Regulator; Part Description: 1.4 V to 19.1 V, 1A, Low Noise (3uVrms), Low-Dropout Linear Regulator; Manufacturer: TEXAS INSTRUMENTS; Table: Regulators; Part Number: TPS7A4700RGWT; Component Kind: Standard; Component Type: Standard; Device: TPS7A4700RGWT; PackageDescription: QFN, 0.65mm pitch,square; 20 pin, 5mm X 5mm X 1mm H body (w/thermal tab 3.25 X 3.25mm),  IPC Medium Density; Manufacturer Part Number: TPS7A4700RGWT; Pin Count: 21; Case: QFN20; Mounted: Yes; Socket: No; SMD: Yes; ComponentHeight: 1mm; HelpURL: \\cern.ch\dfs\Applications\Altium\Datasheets\TPS7A4700RGWT.pdf; Author: CERN DEM JLC; CreateDate: 3/7/2012; LatestRevisionDate: 3/7/2012
  IC6: Footprint: QFN65P500X500X100-21N-S325_mod
IC8 = LTM4601: 4.5V-20V To 0.6V-5V, Iout 6A DC/DC low EMI uModule; Supplier 1: Digi-Key; Supplier Part Number 1: LTM4606EV#PBF-ND
L3 L6 L7 L12 L13 = IND0805_MURATA_BLM21PG221SN1D: Inductor; Part Description: SMD EMIFIL Suppression Chip Ferrite Bead; Manufacturer: MURATA; Power: 2A; Resistance: 0.05R; Tolerance: ±25%; Table: Inductors SMD; Part Number: IND0805_MURATA_BLM21PG221SN1D; Component Kind: Standard; Component Type: Standard; Pin Count: 2; Value: 220R@100MHz; Status: None; Manufacturer Part Number: BLM21PG221SN1D; Case: 0805; Mounted: Yes; Socket: No; SMD: Yes; ComponentHeight: 1.05mm; HelpURL: \\cern.ch\dfs\Applications\Altium\Datasheets\IND0402_MURATA_BLM21P.pdf; Author: CERN DEM JLC; CreateDate: 25/1/2010; LatestRevisionDate: 25/1/2010
L9 L10 L15 = L_CHOKE_ELLVGG: 2.2uH, 1.4A, 92mR Panasonic
R78 R79 = R0402_100K_1%_0.0625W_100PPM: Resistor - 1%; Part Description: General Purpose Thick Film Chip Resistor; Manufacturer: GENERIC; Manufacturer1 Part Number: 232270671004L; TC: ±100ppm/°C; Table: Resistors SMD; Part Number: R0402_100K_1%_0.0625W_100PPM; Component Kind: Standard; Component Type: Standard; Pin Count: 2; Value: 100k; Status: Not recommended; Power: 0.0625W; Tolerance: ±1%; Manufacturer Part Number: R0402_100K_1%_0.0625W_100PPM; Case: 0402; Mounted: Yes; Socket: No; SMD: Yes; Manufacturer1 Example: YAGEO PHYCOMP; Manufacturer1 ComponentHeight: 0.4mm; HelpURL: \\cern.ch\dfs\Applications\Altium\Datasheets\R0402_Phycomp_RC0402.pdf; Author: CERN DEM JLC; CreateDate: 3/12/2007; LatestRevisionDate: 17/10/2012
R80 = R0402_10K_1%_0.0625W_100PPM: Resistor - 1%; Part Description: General Purpose Thick Film Chip Resistor; Manufacturer: GENERIC; Manufacturer1 Part Number: 232270671003L; TC: ±100ppm/°C; Table: Resistors SMD; Part Number: R0402_10K_1%_0.0625W_100PPM; Component Kind: Standard; Component Type: Standard; Pin Count: 2; Value: 10k; Status: Not recommended; Power: 0.0625W; Tolerance: ±1%; Manufacturer Part Number: R0402_10K_1%_0.0625W_100PPM; Case: 0402; Mounted: Yes; Socket: No; SMD: Yes; Manufacturer1 Example: YAGEO PHYCOMP; Manufacturer1 ComponentHeight: 0.4mm; HelpURL: \\cern.ch\dfs\Applications\Altium\Datasheets\R0402_Phycomp_RC0402.pdf; Author: CERN DEM JLC; CreateDate: 3/12/2007; LatestRevisionDate: 17/10/2012
R81 R82 = R0402_150K_1%_0.0625W_100PPM: Resistor - 1%; Part Description: General Purpose Thick Film Chip Resistor; Manufacturer: GENERIC; Manufacturer1 Part Number: 232270671504L; TC: ±100ppm/°C; Table: Resistors SMD; Part Number: R0402_150K_1%_0.0625W_100PPM; Component Kind: Standard; Component Type: Standard; Pin Count: 2; Value: 150k; Status: Not recommended; Power: 0.0625W; Tolerance: ±1%; Manufacturer Part Number: R0402_150K_1%_0.0625W_100PPM; Case: 0402; Mounted: Yes; Socket: No; SMD: Yes; Manufacturer1 Example: YAGEO PHYCOMP; Manufacturer1 ComponentHeight: 0.4mm; HelpURL: \\cern.ch\dfs\Applications\Altium\Datasheets\R0402_Phycomp_RC0402.pdf; Author: CERN DEM JLC; CreateDate: 3/12/2007; LatestRevisionDate: 17/10/2012
R83 = R0402_390K_1%_0.0625W_100PPM: Resistor - 1%; Part Description: General Purpose Thick Film Chip Resistor; Manufacturer: GENERIC; Manufacturer1 Part Number: 232270673904L; TC: ±100ppm/°C; Table: Resistors SMD; Part Number: R0402_390K_1%_0.0625W_100PPM; Component Kind: Standard; Component Type: Standard; Pin Count: 2; Value: 390k; Status: Not recommended; Power: 0.0625W; Tolerance: ±1%; Manufacturer Part Number: R0402_390K_1%_0.0625W_100PPM; Case: 0402; Mounted: Yes; Socket: No; SMD: Yes; Manufacturer1 Example: YAGEO PHYCOMP; Manufacturer1 ComponentHeight: 0.4mm; HelpURL: \\cern.ch\dfs\Applications\Altium\Datasheets\R0402_Phycomp_RC0402.pdf; Author: CERN DEM JLC; CreateDate: 3/12/2007; LatestRevisionDate: 17/10/2012

## Sheet FMC connector.SchDoc: FMC connector
size 420 x 297 mm; SheetNumber: 5; SheetTotal: 8
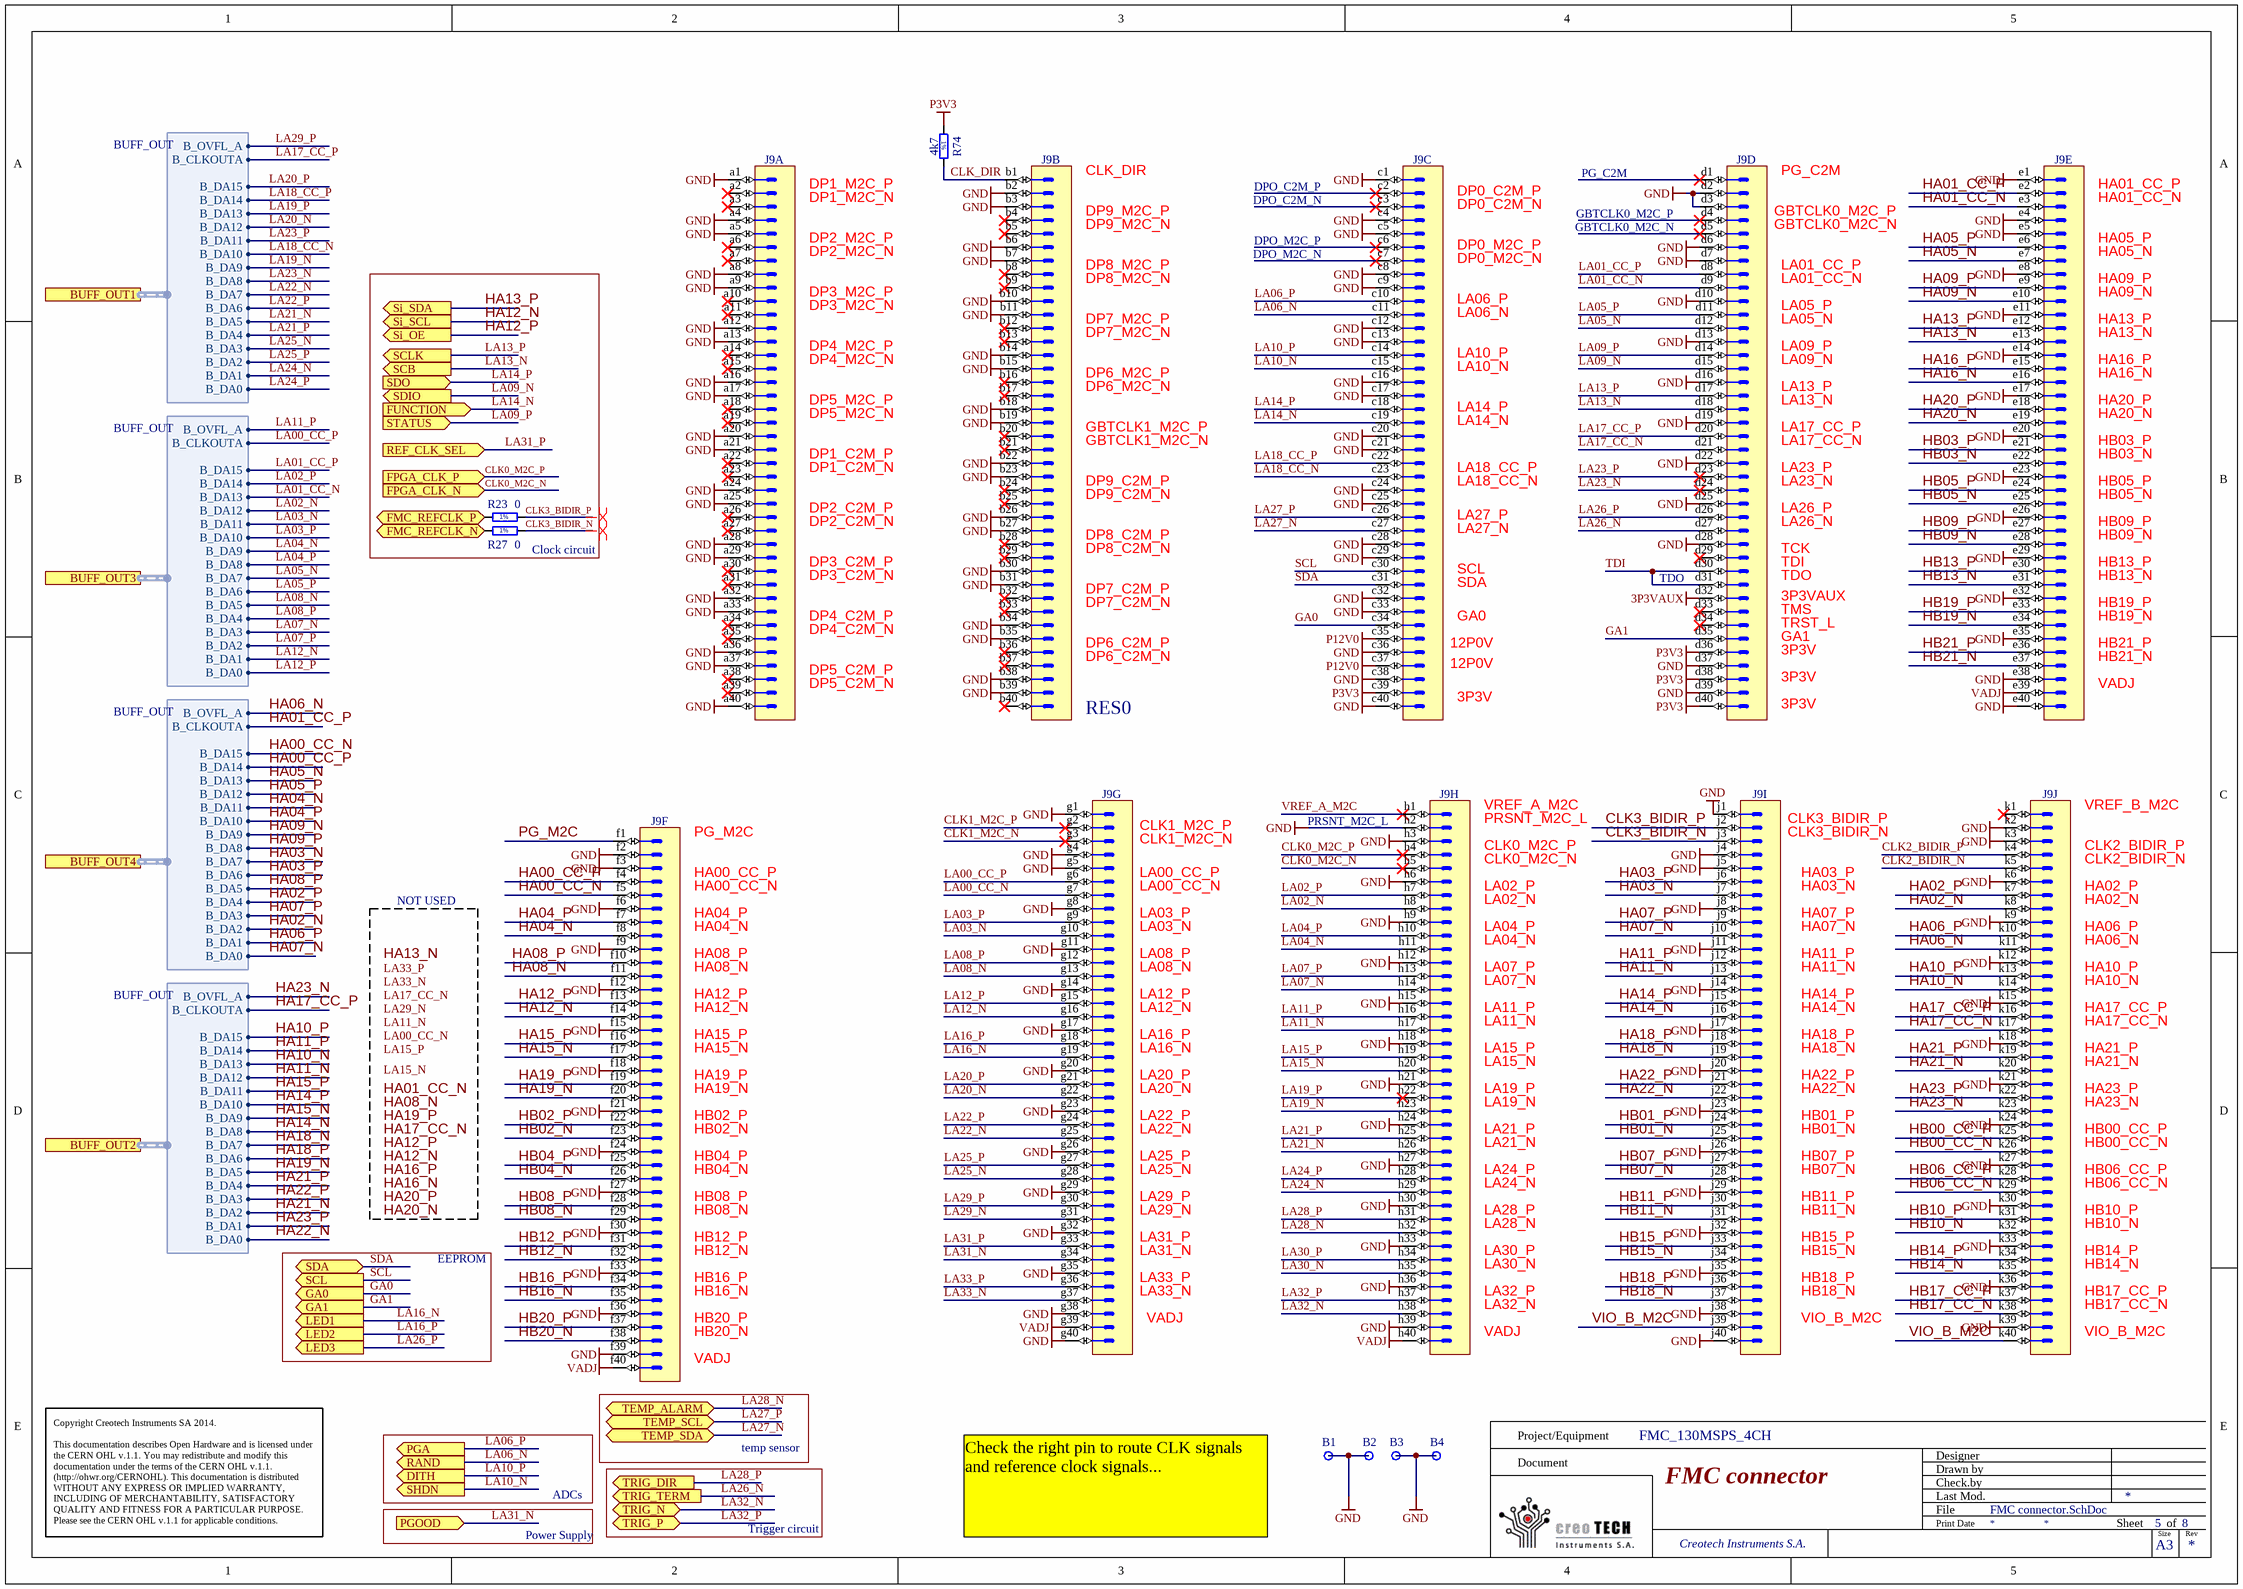
[diagram p2: FMC connector.SchDoc]

### Parts
B1  Plated Hole  [MTG300_600]  (value not drawn)
B2  Plated Hole  [MTG300_600]  (value not drawn)
B3  Plated Hole  [MTG300_600]  (value not drawn)
B4  Plated Hole  [MTG300_600]  (value not drawn)
J9  VITA 57  [SAMTEC_ASP-134488-01]  (value not drawn)  (parts A,B,C,D,E,F,G,H,I,J of 10)
R23  0  [RESC1005X40N]
R27  0  [RESC1005X40N]
R74  4k7  [RESC1608X55N]

### Blocks framed on the sheet
Clock circuit: R23 R27

### Ports
BUFF_OUT1 (harness BUFF_OUT), BUFF_OUT2 (harness BUFF_OUT), BUFF_OUT3 (harness BUFF_OUT), BUFF_OUT4 (harness BUFF_OUT), DITH (out), FMC_REFCLK_N (out), FMC_REFCLK_P (out), FPGA_CLK_N (in), FPGA_CLK_P (in), FUNCTION (in), GA0 (out), GA1 (out), LED1 (out), LED2 (out), LED3 (out), PGA (out), PGOOD (in), RAND (out), REF_CLK_SEL (in), SCB (out), SCL (out), SCLK (out), SDA (bidir), SDIO (out), SDO (in), SHDN (out), Si_OE (out), Si_SCL (out), Si_SDA (out), STATUS (in), TEMP_ALARM (bidir), TEMP_SCL (bidir), TEMP_SDA (bidir), TRIG_DIR (out), TRIG_N (bidir), TRIG_P (bidir), TRIG_TERM (out)

### Harnesses
BUFF_OUT: B_CLKOUTA, B_OVFL_A, B_DA0, B_DA1, B_DA2, B_DA3, B_DA4, B_DA5, B_DA6, B_DA7, B_DA8, B_DA9, B_DA10, B_DA11, B_DA12, B_DA13, B_DA14, B_DA15

### Nets
3P3VAUX: J9.d32
GND: B1.1 B2.1 B3.1 B4.1 J9.a1 J9.a4 J9.a5 J9.a8 J9.a9 J9.a12 J9.a13 J9.a16 J9.a17 J9.a20 J9.a21 J9.a24 J9.a25 J9.a28 J9.a29 J9.a32 J9.a33 J9.a36 J9.a37 J9.a40 J9.b2 J9.b3 J9.b6 J9.b7 J9.b10 J9.b11 J9.b14 J9.b15 J9.b18 J9.b19 J9.b22 J9.b23 J9.b26 J9.b27 J9.b30 J9.b31 J9.b34 J9.b35 J9.b38 J9.b39 J9.c1 J9.c4 J9.c5 J9.c8 J9.c9 J9.c12 J9.c13 J9.c16 J9.c17 J9.c20 J9.c21 J9.c24 J9.c25 J9.c28 J9.c29 J9.c32 J9.c33 J9.c36 J9.c38 J9.c40 J9.d2 J9.d3 J9.d6 J9.d7 J9.d10 J9.d13 J9.d16 J9.d19 J9.d22 J9.d25 J9.d28 J9.d37 J9.d39 J9.e1 J9.e4 J9.e5 J9.e8 J9.e11 J9.e14 J9.e17 J9.e20 J9.e23 J9.e26 J9.e29 J9.e32 J9.e35 J9.e38 J9.e40 J9.f2 J9.f3 J9.f6 J9.f9 J9.f12 J9.f15 J9.f18 J9.f21 J9.f24 J9.f27 J9.f30 J9.f33 J9.f36 J9.f39 J9.g1 J9.g4 J9.g5 J9.g8 J9.g11 J9.g14 J9.g17 J9.g20 J9.g23 J9.g26 J9.g29 J9.g32 J9.g35 J9.g38 J9.g40 J9.h2 J9.h3 J9.h6 J9.h9 J9.h12 J9.h15 J9.h18 J9.h21 J9.h24 J9.h27 J9.h30 J9.h33 J9.h36 J9.h39 J9.j1 J9.j4 J9.j5 J9.j8 J9.j11 J9.j14 J9.j17 J9.j20 J9.j23 J9.j26 J9.j29 J9.j32 J9.j35 J9.j38 J9.j40 J9.k2 J9.k3 J9.k6 J9.k9 J9.k12 J9.k15 J9.k18 J9.k21 J9.k24 J9.k27 J9.k30 J9.k33 J9.k36 J9.k39
P3V3: J9.c39 J9.d36 J9.d38 J9.d40 R74.1
P12V0: J9.c35 J9.c37
VADJ: J9.e39 J9.f40 J9.g39 J9.h40
CLK0_M2C_N: J9.h5 ; port FPGA_CLK_N
CLK0_M2C_P: J9.h4 ; port FPGA_CLK_P
CLK1_M2C_N: J9.g3
CLK1_M2C_P: J9.g2
CLK2_BIDIR_N: J9.k5
CLK2_BIDIR_P: J9.k4
CLK3_BIDIR_N: J9.j3 R27.2
CLK3_BIDIR_P: J9.j2 R23.2
CLK_DIR: J9.b1 R74.2
FMC_REFCLK_N: R27.1 ; port FMC_REFCLK_N
FMC_REFCLK_P: R23.1 ; port FMC_REFCLK_P
GA0: J9.c34 ; port GA0
GA1: J9.d35 ; port GA1
HA00_CC_N: J9.f5 ; port BUFF_OUT4.B_DA15  [project net B_DA15]
HA00_CC_P: J9.f4 ; port BUFF_OUT4.B_DA14  [project net B_DA14]
HA01_CC_N: J9.e3
HA01_CC_P: J9.e2 ; port BUFF_OUT4.B_CLKOUTA  [project net B_CLKOUTA]
HA02_N: J9.k8 ; port BUFF_OUT4.B_DA2  [project net B_DA2]
HA02_P: J9.k7 ; port BUFF_OUT4.B_DA4  [project net B_DA4]
HA03_N: J9.j7 ; port BUFF_OUT4.B_DA7  [project net B_DA7]
HA03_P: J9.j6 ; port BUFF_OUT4.B_DA6  [project net B_DA6]
HA04_N: J9.f8 ; port BUFF_OUT4.B_DA11  [project net B_DA11]
HA04_P: J9.f7 ; port BUFF_OUT4.B_DA10  [project net B_DA10]
HA05_N: J9.e7 ; port BUFF_OUT4.B_DA13  [project net B_DA13]
HA05_P: J9.e6 ; port BUFF_OUT4.B_DA12  [project net B_DA12]
HA06_N: J9.k11 ; port BUFF_OUT4.B_OVFL_A  [project net B_OVFL_A]
HA06_P: J9.k10 ; port BUFF_OUT4.B_DA1  [project net B_DA1]
HA07_N: J9.j10 ; port BUFF_OUT4.B_DA0  [project net B_DA0]
HA07_P: J9.j9 ; port BUFF_OUT4.B_DA3  [project net B_DA3]
HA08_N: J9.f11
HA08_P: J9.f10 ; port BUFF_OUT4.B_DA5  [project net B_DA5]
HA09_N: J9.e10 ; port BUFF_OUT4.B_DA9  [project net B_DA9]
HA09_P: J9.e9 ; port BUFF_OUT4.B_DA8  [project net B_DA8]
HA10_N: J9.k14 ; port BUFF_OUT2.B_DA13  [project net B_DA13]
HA10_P: J9.k13 ; port BUFF_OUT2.B_DA15  [project net B_DA15]
HA11_N: J9.j13 ; port BUFF_OUT2.B_DA12  [project net B_DA12]
HA11_P: J9.j12 ; port BUFF_OUT2.B_DA14  [project net B_DA14]
HA12_N: J9.f14 ; port Si_SCL
HA12_P: J9.f13 ; port Si_OE
HA13_N: J9.e13
HA13_P: J9.e12 ; port Si_SDA
HA14_N: J9.j16 ; port BUFF_OUT2.B_DA8  [project net B_DA8]
HA14_P: J9.j15 ; port BUFF_OUT2.B_DA10  [project net B_DA10]
HA15_N: J9.f17 ; port BUFF_OUT2.B_DA9  [project net B_DA9]
HA15_P: J9.f16 ; port BUFF_OUT2.B_DA11  [project net B_DA11]
HA16_N: J9.e16
HA16_P: J9.e15
HA17_CC_N: J9.k17
HA17_CC_P: J9.k16 ; port BUFF_OUT2.B_CLKOUTA  [project net B_CLKOUTA]
HA18_N: J9.j19 ; port BUFF_OUT2.B_DA7  [project net B_DA7]
HA18_P: J9.j18 ; port BUFF_OUT2.B_DA6  [project net B_DA6]
HA19_N: J9.f20 ; port BUFF_OUT2.B_DA5  [project net B_DA5]
HA19_P: J9.f19
HA20_N: J9.e19
HA20_P: J9.e18
HA21_N: J9.k20 ; port BUFF_OUT2.B_DA2  [project net B_DA2]
HA21_P: J9.k19 ; port BUFF_OUT2.B_DA4  [project net B_DA4]
HA22_N: J9.j22 ; port BUFF_OUT2.B_DA0  [project net B_DA0]
HA22_P: J9.j21 ; port BUFF_OUT2.B_DA3  [project net B_DA3]
HA23_N: J9.k23 ; port BUFF_OUT2.B_OVFL_A  [project net B_OVFL_A]
HA23_P: J9.k22 ; port BUFF_OUT2.B_DA1  [project net B_DA1]
HB00_CC_N: J9.k26
HB00_CC_P: J9.k25
HB01_N: J9.j25
HB01_P: J9.j24
HB02_N: J9.f23
HB02_P: J9.f22
HB03_N: J9.e22
HB03_P: J9.e21
HB04_N: J9.f26
HB04_P: J9.f25
HB05_N: J9.e25
HB05_P: J9.e24
HB06_CC_N: J9.k29
HB06_CC_P: J9.k28
HB07_N: J9.j28
HB07_P: J9.j27
HB08_N: J9.f29
HB08_P: J9.f28
HB09_N: J9.e28
HB09_P: J9.e27
HB10_N: J9.k32
HB10_P: J9.k31
HB11_N: J9.j31
HB11_P: J9.j30
HB12_N: J9.f32
HB12_P: J9.f31
HB13_N: J9.e31
HB13_P: J9.e30
HB14_N: J9.k35
HB14_P: J9.k34
HB15_N: J9.j34
HB15_P: J9.j33
HB16_N: J9.f35
HB16_P: J9.f34
HB17_CC_N: J9.k38
HB17_CC_P: J9.k37
HB18_N: J9.j37
HB18_P: J9.j36
HB19_N: J9.e34
HB19_P: J9.e33
HB20_N: J9.f38
HB20_P: J9.f37
HB21_N: J9.e37
HB21_P: J9.e36
LA00_CC_N: J9.g7
LA00_CC_P: J9.g6 ; port BUFF_OUT3.B_CLKOUTA  [project net B_CLKOUTA]
LA01_CC_N: J9.d9 ; port BUFF_OUT3.B_DA13  [project net B_DA13]
LA01_CC_P: J9.d8 ; port BUFF_OUT3.B_DA15  [project net B_DA15]
LA02_N: J9.h8 ; port BUFF_OUT3.B_DA12  [project net B_DA12]
LA02_P: J9.h7 ; port BUFF_OUT3.B_DA14  [project net B_DA14]
LA03_N: J9.g10 ; port BUFF_OUT3.B_DA11  [project net B_DA11]
LA03_P: J9.g9 ; port BUFF_OUT3.B_DA10  [project net B_DA10]
LA04_N: J9.h11 ; port BUFF_OUT3.B_DA9  [project net B_DA9]
LA04_P: J9.h10 ; port BUFF_OUT3.B_DA8  [project net B_DA8]
LA05_N: J9.d12 ; port BUFF_OUT3.B_DA7  [project net B_DA7]
LA05_P: J9.d11 ; port BUFF_OUT3.B_DA6  [project net B_DA6]
LA06_N: J9.c11 ; port RAND
LA06_P: J9.c10 ; port PGA
LA07_N: J9.h14 ; port BUFF_OUT3.B_DA3  [project net B_DA3]
LA07_P: J9.h13 ; port BUFF_OUT3.B_DA2  [project net B_DA2]
LA08_N: J9.g13 ; port BUFF_OUT3.B_DA5  [project net B_DA5]
LA08_P: J9.g12 ; port BUFF_OUT3.B_DA4  [project net B_DA4]
LA09_N: J9.d15 ; port SDIO
LA09_P: J9.d14 ; port STATUS
LA10_N: J9.c15 ; port SHDN
LA10_P: J9.c14 ; port DITH  [project net DITH]
LA11_N: J9.h17
LA11_P: J9.h16 ; port BUFF_OUT3.B_OVFL_A  [project net B_OVFL_A]
LA12_N: J9.g16 ; port BUFF_OUT3.B_DA1  [project net B_DA1]
LA12_P: J9.g15 ; port BUFF_OUT3.B_DA0  [project net B_DA0]
LA13_N: J9.d18 ; port SCB
LA13_P: J9.d17 ; port SCLK
LA14_N: J9.c19 ; port FUNCTION  [project net FUNCTION]
LA14_P: J9.c18 ; port SDO
LA15_N: J9.h20
LA15_P: J9.h19
LA16_N: J9.g19 ; port LED1
LA16_P: J9.g18 ; port LED2
LA17_CC_N: J9.d21
LA17_CC_P: J9.d20 ; port BUFF_OUT1.B_CLKOUTA  [project net B_CLKOUTA]
LA18_CC_N: J9.c23 ; port BUFF_OUT1.B_DA10  [project net B_DA10]
LA18_CC_P: J9.c22 ; port BUFF_OUT1.B_DA14  [project net B_DA14]
LA19_N: J9.h23 ; port BUFF_OUT1.B_DA9  [project net B_DA9]
LA19_P: J9.h22 ; port BUFF_OUT1.B_DA13  [project net B_DA13]
LA20_N: J9.g22 ; port BUFF_OUT1.B_DA12  [project net B_DA12]
LA20_P: J9.g21 ; port BUFF_OUT1.B_DA15  [project net B_DA15]
LA21_N: J9.h26 ; port BUFF_OUT1.B_DA5  [project net B_DA5]
LA21_P: J9.h25 ; port BUFF_OUT1.B_DA4  [project net B_DA4]
LA22_N: J9.g25 ; port BUFF_OUT1.B_DA7  [project net B_DA7]
LA22_P: J9.g24 ; port BUFF_OUT1.B_DA6  [project net B_DA6]
LA23_N: J9.d24 ; port BUFF_OUT1.B_DA8  [project net B_DA8]
LA23_P: J9.d23 ; port BUFF_OUT1.B_DA11  [project net B_DA11]
LA24_N: J9.h29 ; port BUFF_OUT1.B_DA1  [project net B_DA1]
LA24_P: J9.h28 ; port BUFF_OUT1.B_DA0  [project net B_DA0]
LA25_N: J9.g28 ; port BUFF_OUT1.B_DA3  [project net B_DA3]
LA25_P: J9.g27 ; port BUFF_OUT1.B_DA2  [project net B_DA2]
LA26_N: J9.d27 ; port TRIG_TERM
LA26_P: J9.d26 ; port LED3
LA27_N: J9.c27 ; port TEMP_SDA
LA27_P: J9.c26 ; port TEMP_SCL
LA28_N: J9.h32 ; port TEMP_ALARM
LA28_P: J9.h31 ; port TRIG_DIR
LA29_N: J9.g31
LA29_P: J9.g30 ; port BUFF_OUT1.B_OVFL_A  [project net B_OVFL_A]
LA30_N: J9.h35
LA30_P: J9.h34
LA31_N: J9.g34 ; port PGOOD
LA31_P: J9.g33 ; port REF_CLK_SEL
LA32_N: J9.h38 ; port TRIG_N
LA32_P: J9.h37 ; port TRIG_P
LA33_N: J9.g37
LA33_P: J9.g36
PG_M2C: J9.f1
SCL: J9.c30 ; port SCL
SDA: J9.c31 ; port SDA
TDI: J9.d30 J9.d31
VIO_B_M2C: J9.j39 J9.k40
VREF_A_M2C: J9.h1

Not connected (* = marked no-connect by the designer): J9 a2* a3* a6* a7* a10* a11* a14* a15* a18* a19* a22* a23* a26* a27* a30* a31* a34* a35* a38* a39* b4* b5* b8* b9* b12* b13* b16* b17* b20* b21* b24* b25* b28* b29* b32* b33* b36* b37* b40* c2* c3* c6* c7* d1* d4* d5* d29* d33* d34* k1*

### Layout directives
differential pair: CLK3_BIDIR_N, CLK3_BIDIR_P

### Notes on the sheet
- DP1_M2C_P
- CLK_DIR
- DPO_C2M_P
- PG_C2M
- HA01_CC_P
- DP1_M2C_N
- DP2_M2C_P
- DP2_M2C_N
- DP9_M2C_P
- DP9_M2C_N
- DPO_C2M_N
- DPO_M2C_P
- DPO_M2C_N
- DP0_C2M_P
- DP0_C2M_N
- DP0_M2C_P
- DP0_M2C_N
- GBTCLK0_M2C_P
- GBTCLK0_M2C_N
- (near J9) GBTCLK0_M2C_P
- (near J9) GBTCLK0_M2C_N
- HA01_CC_N
- HA05_P
- HA05_N
- DP3_M2C_P
- DP3_M2C_N
- DP8_M2C_P
- DP8_M2C_N
- DP7_M2C_P
- LA06_P
- LA06_N
- LA01_CC_P
- LA01_CC_N
- LA05_P
- LA05_N
- HA09_P
- HA09_N
- HA13_P
- DP4_M2C_P
- DP4_M2C_N
- DP7_M2C_N
- DP6_M2C_P
- DP6_M2C_N
- LA10_P
- LA10_N
- LA09_P
- LA09_N
- LA13_P
- HA13_N
- HA16_P
- HA16_N
- DP5_M2C_P
- DP5_M2C_N
- DP1_C2M_P
- GBTCLK1_M2C_P
- GBTCLK1_M2C_N
- LA14_P
- LA14_N
- LA13_N
- LA17_CC_P
- LA17_CC_N
- HA20_P
- HA20_N
- HB03_P
- HB03_N
- DP1_C2M_N
- DP2_C2M_P
- DP2_C2M_N
- DP9_C2M_P
- DP9_C2M_N
- LA18_CC_P
- LA18_CC_N
- LA27_P
- LA27_N
- LA23_P
- LA23_N
- LA26_P
- LA26_N
- HB05_P
- HB05_N
- HB09_P
- DP3_C2M_P
- DP3_C2M_N
- DP8_C2M_P
- DP8_C2M_N
- DP7_C2M_P
- SCL
- SDA
- (near J9) TDO
- TCK
- TDI
- TDO
- HB09_N
- HB13_P
- HB13_N
- DP4_C2M_P
- DP4_C2M_N
- DP7_C2M_N
- DP6_C2M_P
- DP6_C2M_N
- (near J9) 12P0V
- GA0
- 3P3VAUX
- TMS
- TRST_L
- GA1
- 3P3V
- HB19_P
- HB19_N
- HB21_P
- HB21_N
- DP5_C2M_P
- DP5_C2M_N
- RES0
- VADJ
- PG_M2C
- (near J9) CLK1_M2C_P
- (near J9) CLK1_M2C_N
- (near J9) PRSNT_M2C_L
- VREF_A_M2C
- PRSNT_M2C_L
- CLK0_M2C_P
- CLK0_M2C_N
- (near J9) CLK3_BIDIR_P
- (near J9) CLK3_BIDIR_N
- VREF_B_M2C
- CLK2_BIDIR_P
- CLK2_BIDIR_N
- NOT USED
- HA00_CC_P
- HA00_CC_N
- HA04_P
- HA04_N
- (near J9) LA00_CC_P
- (near J9) LA00_CC_N
- (near J9) LA03_P
- (near J9) LA03_N
- LA02_P
- LA02_N
- LA04_P
- HA03_P
- HA03_N
- HA07_P
- HA07_N
- HA02_P
- HA02_N
- HA06_P
- HA08_P
- HA08_N
- HA12_P
- (near J9) LA08_P
- (near J9) LA08_N
- (near J9) LA12_P
- LA04_N
- LA07_P
- LA07_N
- HA11_P
- HA11_N
- HA14_P
- HA06_N
- HA10_P
- HA10_N
- HA12_N
- HA15_P
- HA15_N
- (near J9) LA12_N
- (near J9) LA16_P
- (near J9) LA16_N
- LA11_P
- LA11_N
- LA15_P
- LA15_N
- HA14_N
- HA18_P
- HA18_N
- HA17_CC_P
- HA17_CC_N
- HA21_P
- HA21_N
- HA19_P
- HA19_N
- HB02_P
- HB02_N
- (near J9) LA20_P
- (near J9) LA20_N
- (near J9) LA22_P
- (near J9) LA22_N
- LA19_P
- LA19_N
- LA21_P
- HA22_P
- HA22_N
- HB01_P
- HB01_N
- HA23_P
- HA23_N
- HB00_CC_P
- HB04_P
- HB04_N
- HB08_P
- (near J9) LA25_P
- (near J9) LA25_N
- (near J9) LA29_P
- LA21_N
- LA24_P
- LA24_N
- HB07_P
- HB07_N
- HB11_P
- HB00_CC_N
- HB06_CC_P
- HB06_CC_N
- EEPROM
- HB08_N
- HB12_P
- HB12_N
- (near J9) LA29_N
- (near J9) LA31_P
- (near J9) LA31_N
- LA28_P
- LA28_N
- LA30_P
- LA30_N
- HB11_N
- HB15_P
- HB15_N
- HB10_P
- HB10_N
- HB14_P
- HB14_N
- HB16_P
- HB16_N
- HB20_P
- HB20_N
- (near J9) LA33_P
- (near J9) LA33_N
- LA32_P
- LA32_N
- HB18_P
- HB18_N
- VIO_B_M2C
- HB17_CC_P
- HB17_CC_N
- temp sensor
- Power Supply
- ADCs
- Trigger circuit
- Check the right pin to route CLK signals and reference clock signals...
- Labels drawn without touching a wire or pin: HA01_CC_N, HA08_N, HA12_N, HA12_P, HA13_N, HA16_N, HA16_P, HA17_CC_N, HA19_P, HA20_N, HA20_P, LA00_CC_N, LA11_N, LA15_N, LA15_P, LA17_CC_N, LA29_N, LA33_N, LA33_P
- Project/Equipment
- Document
- FMC_130MSPS_4CH
- Designer
- Drawn by
- Check.by
- Copyright Creotech Instruments SA 2014.
  This documentation describes Open Hardware and is licensed under the CERN OHL v.1.1. You may redistribute and modify this documentation under the terms of the CERN OHL v.1.1. (http://ohwr.org/CERNOHL). This documentation is distributed WITHOUT ANY EXPRESS OR IMPLIED WARRANTY, INCLUDING OF MERCHANTABILITY, SATISFACTORY QUALITY AND FITNESS FOR A PARTICULAR PURPOSE. Please see the CERN OHL v.1.1 for applicable conditions.
- Creotech Instruments S.A.
- File
- Last Mod.
- Print Date
- Sheet
- Size
- A3
- of
- Rev
- (in symbol R0402_0R_JUMPER) 1%
- (in symbol R0603_4K7_1%_0.1W_100PPM) 1%

### Library data of the parts
B1-B4 = PLATED_HOLE3.0_PAD6.0: Single Terminal Socket; Part Description: Plated Through Hole: Hole Dia.=3.0mm Pad Dia.=6.0mm; Mounted: No; Table: Pads; Part Number: PLATED_HOLE3.0_PAD6.0; Component Kind: Standard (No BOM); Component Type: Standard (No BOM); Designator: Single Terminal Socket; Library Reference: Single Terminal Socket; Pin Count: 1; Family: Plated Hole; Socket: No; SMD: No; Status: None; ComponentHeight: 0mm; Author: CERN DEM JLC; CreateDate: 26.05.2008; LatestRevisionDate: 26.05.2008; PackageDescription: Plated Through Hole: Hole Dia.=3.0mm Pad Dia.=6.0mm
J9 = SAMTEC_ASP-134488-01: Connector VITA 57, 400 Male contacts in 10 row abcdefghj; Part Description: 400 contacts (10 rows abcdefghj) Surface Mount Male Connector, VITA 57 (MC-HPC-10); Manufacturer: SAMTEC; Part Number: SAMTEC_ASP-134488-01; Component Kind: Standard; Component Type: Standard; Pin Count: 400; Family: VITA 57; Mounted: Yes; Socket: No; SMD: Yes; Status: None; Manufacturer Part Number: ASP-134488-01; ComponentHeight: 6.1mm; HelpURL: \\cern.ch\dfs\Applications\Altium\Datasheets\SAMTEC_ASP-134488-01.pdf; Author: CERN DEM JLC; CreateDate: 30/04/2009; LatestRevisionDate: 17/08/2009; Table: SAMTEC
R23 R27 = R0402_0R_JUMPER: Resistor - 1%; Part Description: 1A (0.05R Max DC Resistance) Zero Ohm Jumper; Manufacturer: GENERIC; Manufacturer1 Part Number: 232270591001L; Table: Resistors SMD; Part Number: R0402_0R_JUMPER; Component Kind: Standard; Component Type: Standard; Pin Count: 2; Value: 0; Status: Not recommended; Manufacturer Part Number: R0402_0R_JUMPER; Case: 0402; Mounted: Yes; Socket: No; SMD: Yes; Manufacturer1 Example: YAGEO PHYCOMP; Manufacturer1 ComponentHeight: 0.4mm; HelpURL: \\cern.ch\dfs\Applications\Altium\Datasheets\R0402_Phycomp_RC0402.pdf; Author: CERN DEM JLC; CreateDate: 3/12/2007; LatestRevisionDate: 17/10/2012
R74 = R0603_4K7_1%_0.1W_100PPM: Resistor - 1%; Part Description: General Purpose Thick Film Chip Resistor; Manufacturer: GENERIC; Manufacturer1 Part Number: NRC06F4701TRF; Power: 0.1W; TC: ±100ppm/°C; Table: Resistors SMD; Part Number: R0603_4K7_1%_0.1W_100PPM; Component Kind: Standard; Component Type: Standard; Pin Count: 2; Value: 4k7; Status: Preferred; Tolerance: ±1%; Manufacturer Part Number: R0603_4K7_1%_0.1W_100PPM; Case: 0603; Mounted: Yes; Socket: No; SMD: Yes; Manufacturer1 Example: NIC COMPONENT; Manufacturer1 ComponentHeight: 0.55mm; HelpURL: \\cern.ch\dfs\Applications\Altium\Datasheets\R0603_NIC_NRC.pdf; Author: CERN DEM JLC; CreateDate: 03/12/2007; LatestRevisionDate: 13/03/2008